# EAGLE board Main (EAGLE 7.4.0)
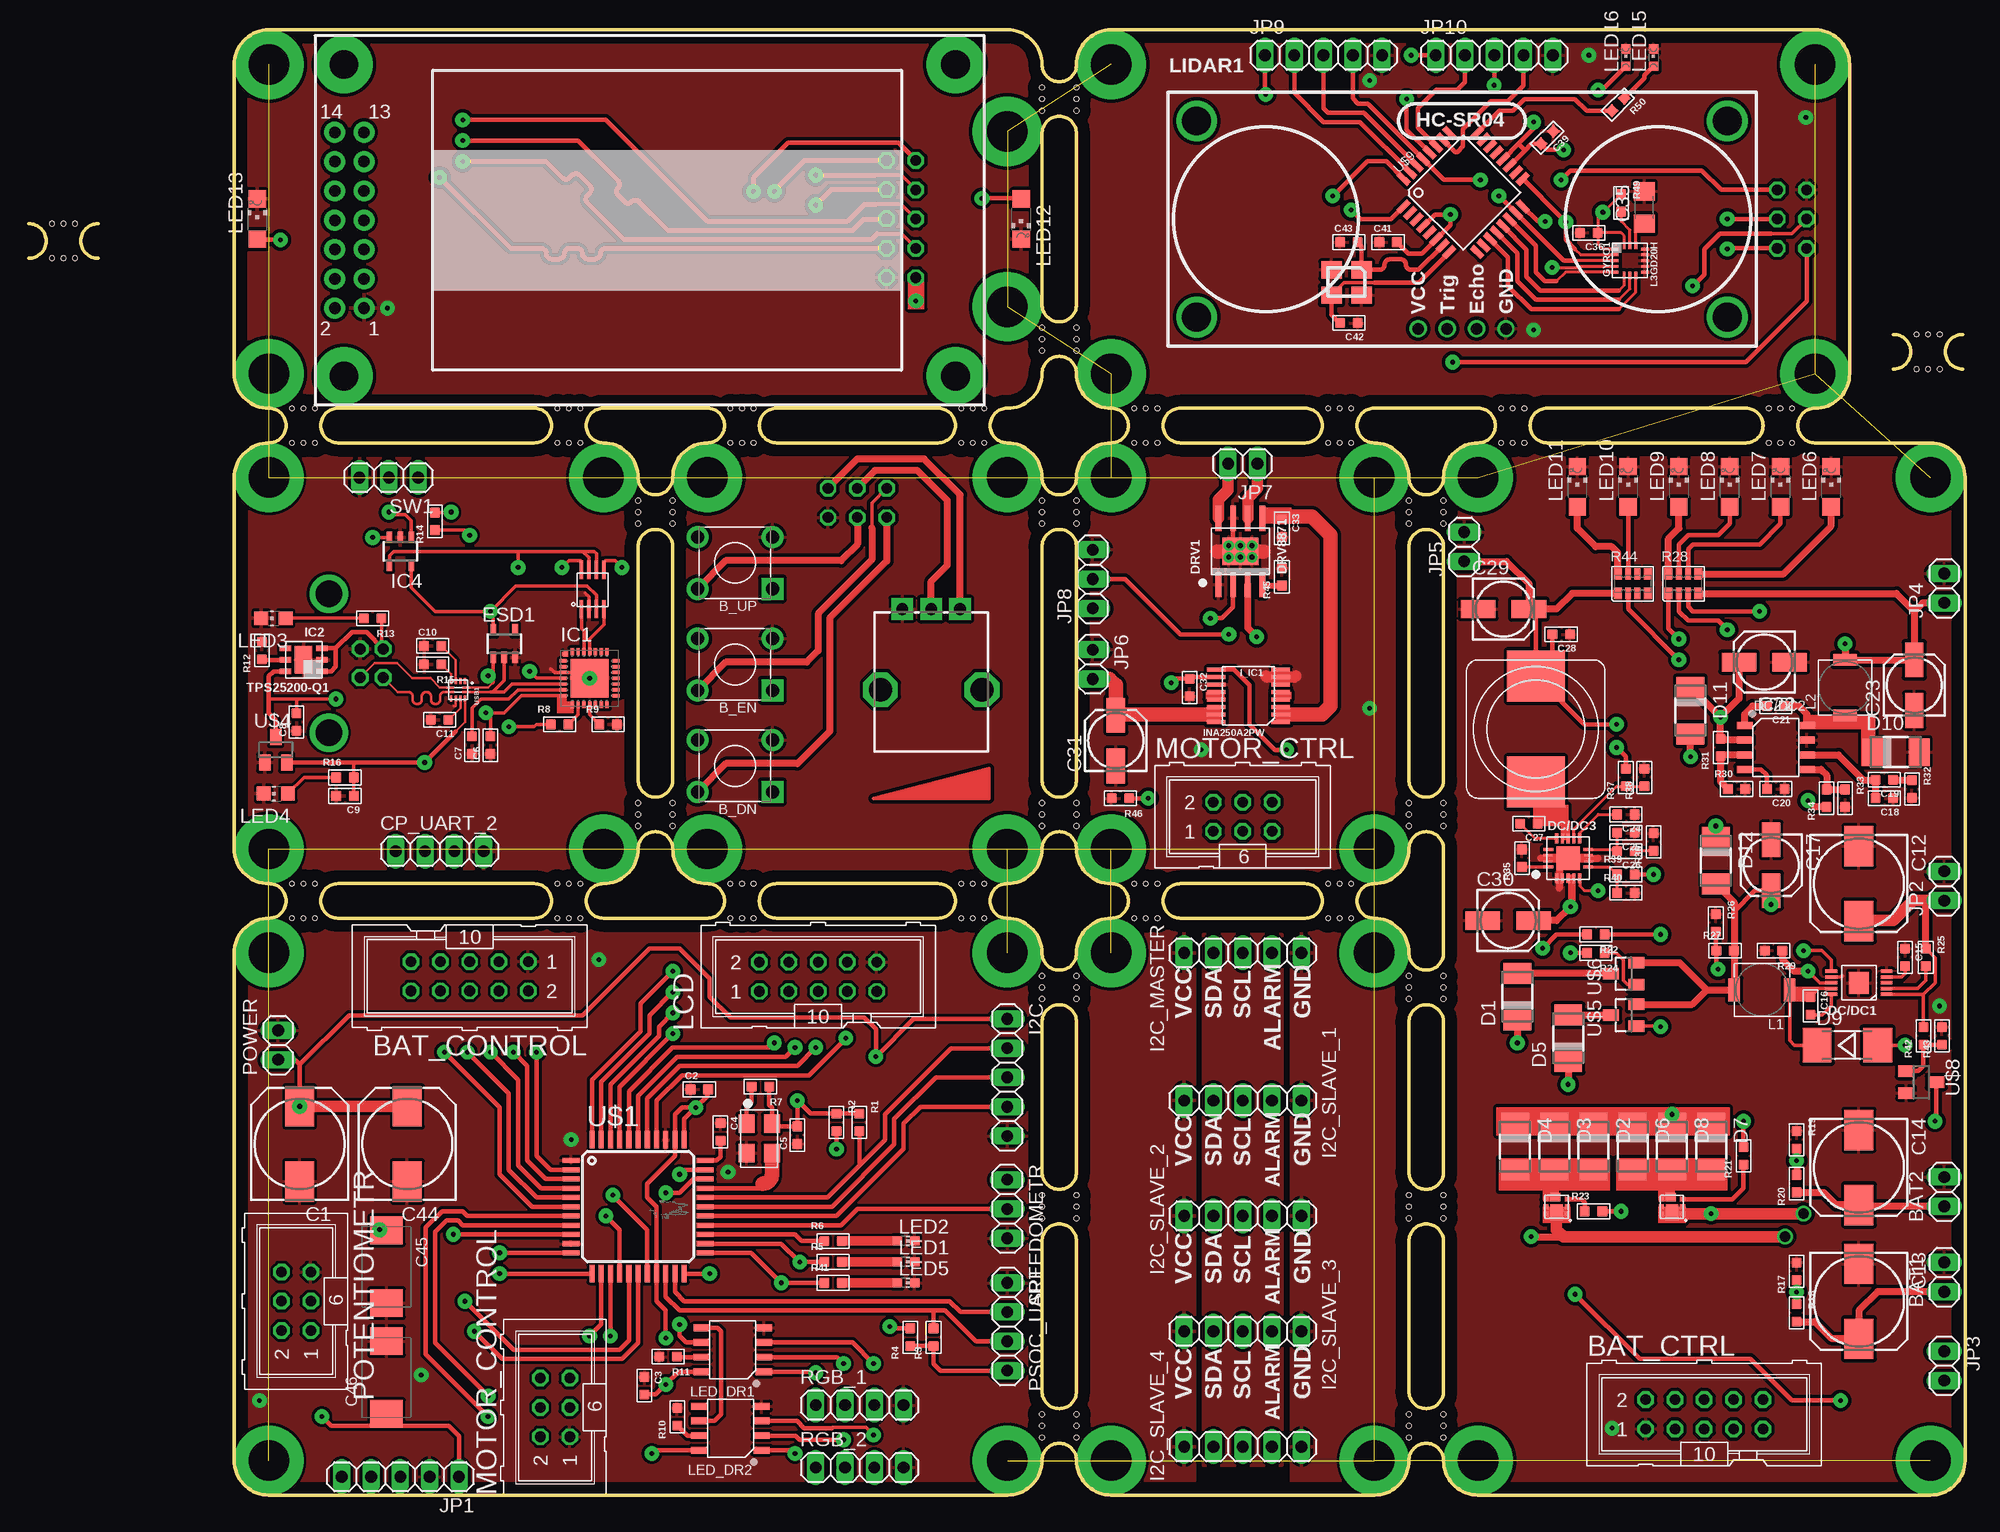
[diagram p5: board, top side]
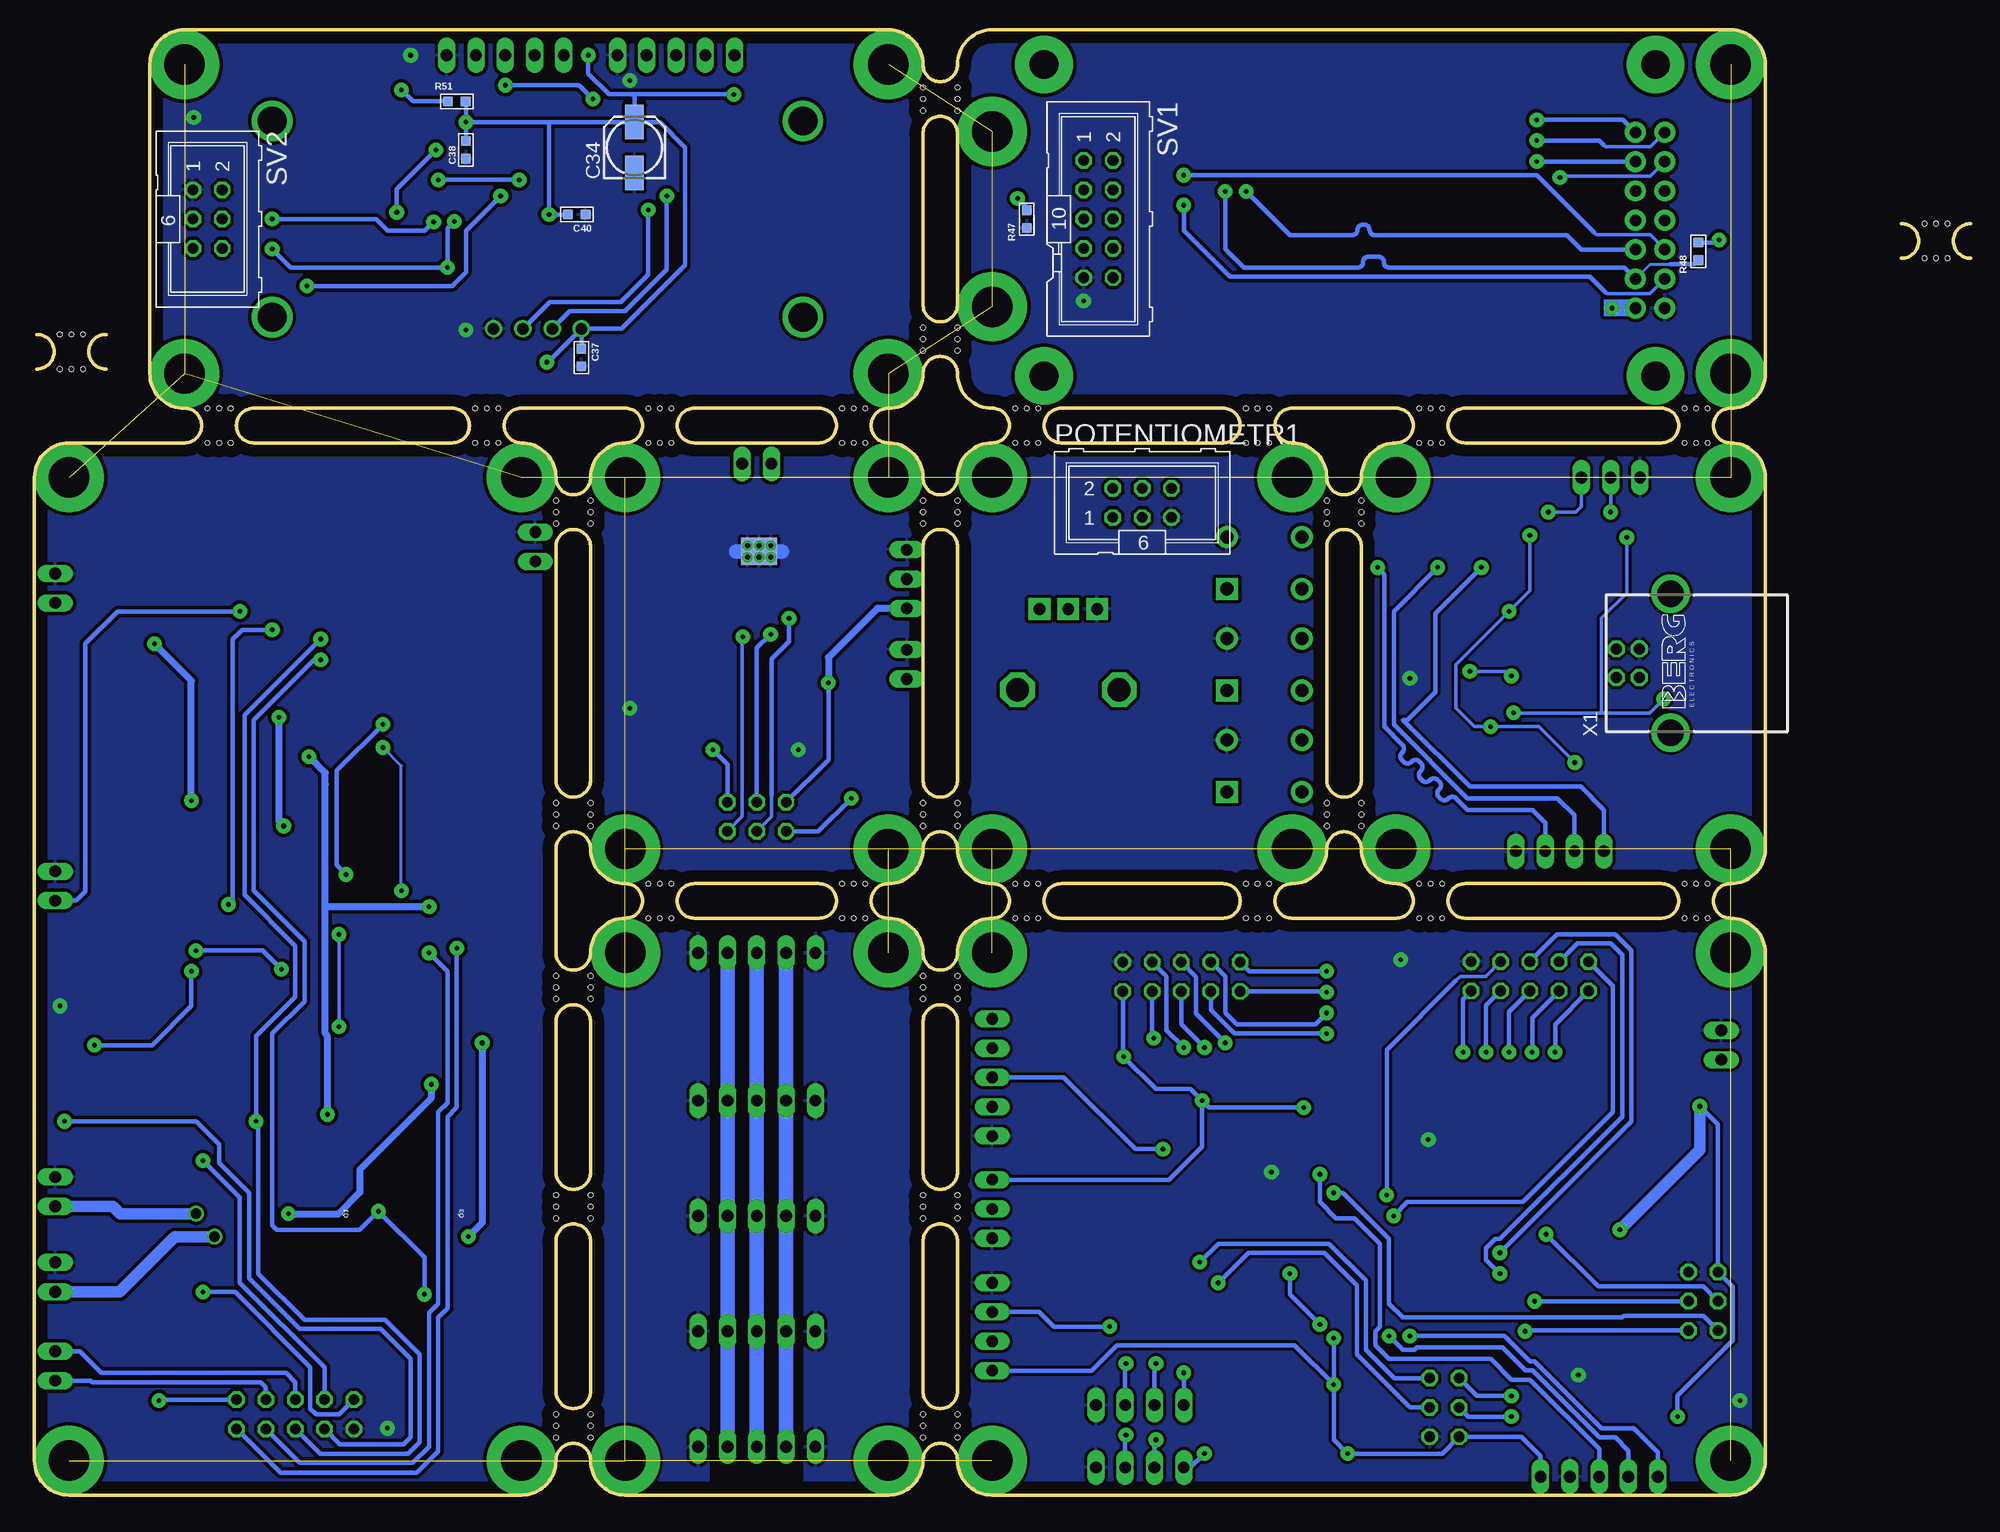
[diagram p6: board, bottom side, seen from below]

Size 167.8 x 127 mm. Coordinates in mm from the lower left corner, seen from the top.
Outline: 6,107.2 arc-180 6,110.2
Outline: 0,110.2 arc-180 0,107.2
Outline: 167.6,97.6 arc-180 167.6,100.6
Outline: 161.6,100.6 arc-180 161.6,97.6
Outline: 20.8,0 84.8,0 arc90 87.8,3 arc-180 90.8,3 arc90 93.8,0 116.6,0 arc90 119.6,3 arc-180 122.6,3 arc90 125.6,0 164.8,0 arc90 167.8,3 167.8,88.2 arc90 164.8,91.2 154.8,91.2 arc-180 154.8,94.2 arc90 157.8,97.2 157.8,124 arc90 154.8,127 93.8,127 arc90 90.8,124 arc-180 87.8,124 arc90 84.8,127 20.8,127 arc90 17.8,124 17.8,97.2 arc90 20.8,94.2 arc-180 20.8,91.2 arc90 17.8,88.2 17.8,56 arc90 20.8,53 arc-180 20.8,50 arc90 17.8,47 17.8,3 arc90 20.8,0
Outline: 87.8,47 arc90 84.8,50 arc-180 84.8,53 arc90 87.8,56 arc-180 90.8,56 arc90 93.8,53 arc-180 93.8,50 arc90 90.8,47 arc-180 87.8,47
Outline: 87.8,22 arc-180 90.8,22 90.8,9 arc-180 87.8,9 87.8,22
Outline: 90.8,28 arc-180 87.8,28 87.8,41 arc-180 90.8,41 90.8,28
Outline: 119.6,47 arc90 116.6,50 arc-180 116.6,53 arc90 119.6,56 arc-180 122.6,56 122.6,47 arc-180 119.6,47
Outline: 84.8,91.2 arc-180 84.8,94.2 arc90 87.8,97.2 arc-180 90.8,97.2 arc90 93.8,94.2 arc-180 93.8,91.2 arc90 90.8,88.2 arc-180 87.8,88.2 arc90 84.8,91.2
Outline: 78.8,94.2 arc-180 78.8,91.2 64.8,91.2 arc-180 64.8,94.2 78.8,94.2
Outline: 26.8,50 arc-180 26.8,53 43.8,53 arc-180 43.8,50 26.8,50
Outline: 78.8,53 arc-180 78.8,50 64.8,50 arc-180 64.8,53 78.8,53
Outline: 49.8,53 arc90 52.8,56 arc-180 55.8,56 arc90 58.8,53 arc-180 58.8,50 49.8,50 arc-180 49.8,53
Outline: 52.8,88.2 arc90 49.8,91.2 arc-180 49.8,94.2 58.8,94.2 arc-180 58.8,91.2 arc90 55.8,88.2 arc-180 52.8,88.2
Outline: 52.8,82.2 arc-180 55.8,82.2 55.8,62 arc-180 52.8,62 52.8,82.2
Outline: 122.6,9 arc-180 119.6,9 119.6,22 arc-180 122.6,22 122.6,9
Outline: 119.6,41 arc-180 122.6,41 122.6,28 arc-180 119.6,28 119.6,41
Outline: 99.8,50 arc-180 99.8,53 110.6,53 arc-180 110.6,50 99.8,50
Outline: 90.8,62 arc-180 87.8,62 87.8,82.2 arc-180 90.8,82.2 90.8,62
Outline: 119.6,88.2 arc90 116.6,91.2 arc-180 116.6,94.2 125.6,94.2 arc-180 125.6,91.2 arc90 122.6,88.2 arc-180 119.6,88.2
Outline: 122.6,62 arc-180 119.6,62 119.6,82.2 arc-180 122.6,82.2 122.6,62
Outline: 26.8,91.2 arc-180 26.8,94.2 43.8,94.2 arc-180 43.8,91.2 26.8,91.2
Outline: 90.8,103.2 arc-180 87.8,103.2 87.8,118 arc-180 90.8,118 90.8,103.2
Outline: 99.8,91.2 arc-180 99.8,94.2 110.6,94.2 arc-180 110.6,91.2 99.8,91.2
Outline: 131.6,91.2 arc-180 131.6,94.2 148.8,94.2 arc-180 148.8,91.2 131.6,91.2
Copper layers (1*16): Top 0.035mm / dielectric 1.5mm / Bottom 0.035mm
Design rules "default": minimum track width 10mil, minimum drill 24mil, track to track 8mil, track to pad 8mil, pad to pad 8mil, via to via 8mil, smd to smd 8mil, copper to edge 40mil, drill to drill 8mil, minimum pad ring 10mil, minimum via ring 8mil, stop-mask expansion 4mil, vias tented up to drill 0mil, thermal gap 10mil
Holes 0.4 mm at 90.8,26 90.8,25 90.8,24 87.8,24 87.8,25 87.8,26 90.8,45 90.8,44 90.8,43 87.8,43 87.8,44 87.8,45 90.8,7 90.8,6 90.8,5 87.8,5 87.8,6 87.8,7 80.8,94.2 81.8,94.2 82.8,94.2 82.8,91.2 81.8,91.2 80.8,91.2 22.8,53 23.8,53 24.8,53 24.8,50 23.8,50 22.8,50 80.8,53 81.8,53 82.8,53 82.8,50 81.8,50 80.8,50 55.8,86.2 55.8,85.2 55.8,84.2 52.8,84.2 52.8,85.2 52.8,86.2 55.8,60 55.8,59 55.8,58 52.8,58 52.8,59 52.8,60 60.8,53 61.8,53 62.8,53 62.8,50 61.8,50 60.8,50 45.8,53 46.8,53 47.8,53 47.8,50 46.8,50 45.8,50 122.6,7 122.6,6 122.6,5 119.6,5 119.6,6 119.6,7 122.6,45 122.6,44 122.6,43 119.6,43 119.6,44 119.6,45 95.8,53 96.8,53 97.8,53 97.8,50 96.8,50 95.8,50 112.6,53 113.6,53 114.6,53 114.6,50 113.6,50 112.6,50 90.8,60 90.8,59 90.8,58 87.8,58 87.8,59 87.8,60 90.8,86.2 90.8,85.2 90.8,84.2 87.8,84.2 87.8,85.2 87.8,86.2 122.6,60 122.6,59 122.6,58 119.6,58 119.6,59 119.6,60 122.6,86.2 122.6,85.2 122.6,84.2 119.6,84.2 119.6,85.2 119.6,86.2 122.6,26 122.6,25 122.6,24 119.6,24 119.6,25 119.6,26 22.8,94.2 23.8,94.2 24.8,94.2 24.8,91.2 23.8,91.2 22.8,91.2 2,110.2 3,110.2 4,110.2 4,107.2 3,107.2 2,107.2 45.8,94.2 46.8,94.2 47.8,94.2 47.8,91.2 46.8,91.2 45.8,91.2 60.8,94.2 61.8,94.2 62.8,94.2 62.8,91.2 61.8,91.2 60.8,91.2 87.8,99.2 87.8,100.2 87.8,101.2 90.8,101.2 90.8,100.2 90.8,99.2 87.8,120 87.8,121 87.8,122 90.8,122 90.8,121 90.8,120 95.8,94.2 96.8,94.2 97.8,94.2 97.8,91.2 96.8,91.2 95.8,91.2 112.6,94.2 113.6,94.2 114.6,94.2 114.6,91.2 113.6,91.2 112.6,91.2 127.6,94.2 128.6,94.2 129.6,94.2 129.6,91.2 128.6,91.2 127.6,91.2 163.6,100.6 164.6,100.6 165.6,100.6 165.6,97.6 164.6,97.6 163.6,97.6 150.8,94.2 151.8,94.2 152.8,94.2 152.8,91.2 151.8,91.2 150.8,91.2

## Footprints (pad centres in the part's own frame; a part is rotated, then mirrored left to right if it is on the bottom)
SW4-6.2X6.2X5.0MM = drill 1.143 pad 1.905 square: 1 -3.25,2.25 | drill 1.143 pad 1.905: 2 -3.25,-2.25; 3 3.25,-2.25; 4 3.25,2.25
1X02 = drill 1.016 long: 1 -1.27,0; 2 1.27,0
ML10 = drill 0.914 octagon: 1 -5.08,-1.27; 2 -5.08,1.27; 3 -2.54,-1.27; 4 -2.54,1.27; 5 0,-1.27; 6 0,1.27; 7 2.54,-1.27; 8 2.54,1.27; 9 5.08,-1.27; 10 5.08,1.27
150CLZ-0810 = smd 3.5 x 2.5: + 3.25,0; - -3.25,0
C0603 = smd 0.889 x 0.889: 1 0,0.762; 2 0,-0.762
153CLV-0810 = smd 3.5 x 2.5: + 3.25,0; - -3.25,0
153CLV-0505 = smd 3 x 1.6: + 2.2,0; - -2.2,0
C1206 = smd 1.6 x 1.8: 1 -1.4,0; 2 1.4,0
SMC_D = smd 2.4 x 2.8: + -3.15,0; - 3.15,0
1X04 = drill 1.016 long: 1 -3.81,0; 2 -1.27,0; 3 1.27,0; 4 3.81,0
DO-214AC = smd 1.8 x 2.4: A 2.025,0; C -2.025,0
MELF-MLL41 = smd 2.5 x 3: A 2.625,0; C -2.625,0
HVSSOP-10 = smd 0.3 x 1.02: 1 -1,-2.4; 2 -0.5,-2.4; 3 0,-2.4; 4 0.5,-2.4; 5 1,-2.4; 6 1,2.4; 7 0.5,2.4; 8 0,2.4; 9 -0.5,2.4; 10 -1,2.4 | smd 1.9 x 1.73: EPAD 0,0
SOIC8-1.27-5X4MM = smd 0.6 x 1.4: 1 -1.905,-2.7; 2 -0.635,-2.7; 3 0.635,-2.7; 4 1.905,-2.7; 5 1.905,2.7; 6 0.635,2.7; 7 -0.635,2.7; 8 -1.905,2.7
VQFN-14_PWR = smd 0.85 x 0.28: 1 -1.725,-0.75; 7 1.725,-0.75; 8 1.725,0.75; 14 -1.725,0.75 | smd 0.28 x 0.85: 2 -1,-1.725; 3 -0.5,-1.725; 4 0,-1.725; 5 0.5,-1.725; 6 1,-1.725; 9 1,1.725; 10 0.5,1.725; 11 0,1.725; 12 -0.5,1.725; 13 -1,1.725 | smd 2.05 x 2.05: EPAD_BIG 0,0 | smd 0.725 x 0.2: EPAD_M1 -1.788,0.275; EPAD_M2 -1.788,-0.275; EPAD_M3 1.788,-0.275; EPAD_M4 1.788,0.275
HTSOP8 = smd 0.5 x 2.2: 1 -1.905,-2.875; 2 -0.635,-2.875; 3 0.635,-2.875; 4 1.905,-2.875; 5 1.905,2.875; 6 0.635,2.875; 7 -0.635,2.875; 8 -1.905,2.875 | smd 3.1 x 2.4 bottom: EPAD_B 0,0 | smd 3.1 x 2.4: EPAD_T 0,0 | drill 0.4: EPAD_VIA1 -1,0.5; EPAD_VIA2 0,0.5; EPAD_VIA3 1,0.5; EPAD_VIA4 1,-0.5; EPAD_VIA5 0,-0.5; EPAD_VIA6 -1,-0.5
SOT23-5 = smd 0.5 x 1: 1 -0.95,-1.2; 2 0,-1.2; 3 0.95,-1.2; 4 0.95,1.2; 5 -0.95,1.2
LGA_3X3_16 = smd 0.25 x 0.65: 1 -1,-1.35; 2 -0.5,-1.35; 3 0,-1.35; 4 0.5,-1.35; 5 1,-1.35; 9 1,1.25; 10 0.5,1.25; 11 0,1.25; 12 -0.5,1.25; 13 -1,1.25 | smd 0.65 x 0.25: 6 1.3,-0.545; 7 1.3,-0.045; 8 1.3,0.455; 14 -1.3,0.455; 15 -1.3,-0.045; 16 -1.3,-0.545
1X05 = drill 1.016 long: 1 -5.08,0; 2 -2.54,0; 3 0,0; 4 2.54,0; 5 5.08,0
SSOP16 = smd 0.35 x 1.6: P$1 -2.3,-2.9; P$2 -1.65,-2.9; P$3 -1,-2.9; P$4 -0.35,-2.9; P$5 0.3,-2.9; P$6 0.95,-2.9; P$7 1.6,-2.9; P$8 2.25,-2.9; P$9 2.25,2.7; P$10 1.6,2.7; P$11 0.95,2.7; P$12 0.3,2.7; P$13 -0.35,2.7; P$14 -1,2.7; P$15 -1.65,2.7; P$16 -2.3,2.7
MLP28 = smd 0.6 x 0.3: 1 -2.3,1.5; 2 -2.3,1; 3 -2.3,0.5; 4 -2.3,0; 5 -2.3,-0.5; 6 -2.3,-1; 7 -2.3,-1.5; 15 2.3,-1.5; 16 2.3,-1; 17 2.3,-0.5; 18 2.3,0; 19 2.3,0.5; 20 2.3,1; 21 2.3,1.5 | smd 0.3 x 0.6: 8 -1.5,-2.3; 9 -1,-2.3; 10 -0.5,-2.3; 11 0,-2.3; 12 0.5,-2.3; 13 1,-2.3; 14 1.5,-2.3; 22 1.5,2.3; 23 1,2.3; 24 0.5,2.3; 25 0,2.3; 26 -0.5,2.3; 27 -1,2.3; 28 -1.5,2.3 | smd 3.3 x 3.3: EXP 0,0 | smd 0.435 x 0.435: M -2.103,2.103
PWSON6 = smd 1.5 x 2.4: EPAD 0,0 | smd 1 x 0.45: P$1 -1.6,1; P$2 -1.6,0; P$3 -1.6,-1; P$4 1.55,-1; P$5 1.55,0; P$6 1.55,1
1X03 = drill 1.016 long: 1 -2.54,0; 2 0,0; 3 2.54,0
INT2-SMD-4.8X4.6X1.0MM = smd 1 x 2: 1 -2.4,0; 2 2.4,0
LDCP = smd 5 x 4.4: P$1 0,4.6; P$2 0,-4.6
CHIP-LED0603 = smd 0.8 x 0.8: A 0,-0.75; C 0,0.75
CHIP-LED0805 = smd 1.2 x 1.2: A 0,-1.05; C 0,1.05
CHIPLED_1206 = smd 1.5 x 1.5: A 0,-1.75; C 0,1.75
CHIPLED_0603 = smd 0.8 x 0.8: A 0,-0.75; C 0,0.75
HC-SR04 = drill 1: 1 -3.81,-9.5; 2 -1.27,-9.5; 3 1.27,-9.5; 4 3.81,-9.5 | drill 2.5: DRIL1 -23,-8.5; DRIL2 -23,8.5; DRIL3 23,8.5; DRIL4 23,-8.5
ML6 = drill 0.914 octagon: 1 -2.54,-1.27; 2 -2.54,1.27; 3 0,-1.27; 4 0,1.27; 5 2.54,-1.27; 6 2.54,1.27
SON_Q2 = smd 0.4 x 0.45: 1 -0.65,-0.922; 2 0,-0.922; 3 0.65,-0.922; 4 0.65,0.922; 5 0,0.922; 6 -0.65,0.922 | smd 0.75 x 0.85: D 0.825,0.096 | smd 1.4 x 1.1: S -0.505,0
R0603 = smd 0.889 x 0.889: 1 0,0.762; 2 0,-0.762
RA1206-8 = smd 0.7 x 1: 1 -1.3,-0.85; 4 1.3,-0.85; 5 1.3,0.85; 8 -1.3,0.85 | smd 0.5 x 1: 2 -0.4,-0.85; 3 0.4,-0.85; 6 0.4,0.85; 7 -0.4,0.85
ALPS_POT = drill 1 pad 1.88 square: P$1 7,-2.5; P$2 7,0; P$3 7,2.5 | drill 2 octagon: P$4 0,-4.4; P$5 0,4.4
TQFP44_CY_LOGO = smd 1.5 x 0.44: 1 -5.8,4; 2 -5.8,3.2; 3 -5.8,2.4; 4 -5.8,1.6; 5 -5.8,0.8; 6 -5.8,0; 7 -5.8,-0.8; 8 -5.8,-1.6; 9 -5.8,-2.4; 10 -5.8,-3.2; 11 -5.8,-4; 23 5.8,-4; 24 5.8,-3.2; 25 5.8,-2.4; 26 5.8,-1.6; 27 5.8,-0.8; 28 5.8,0; 29 5.8,0.8; 30 5.8,1.6; 31 5.8,2.4; 32 5.8,3.2; 33 5.8,4 | smd 0.44 x 1.5: 12 -4,-5.8; 13 -3.2,-5.8; 14 -2.4,-5.8; 15 -1.6,-5.8; 16 -0.8,-5.8; 17 0,-5.8; 18 0.8,-5.8; 19 1.6,-5.8; 20 2.4,-5.8; 21 3.2,-5.8; 22 4,-5.8; 34 4,5.8; 35 3.2,5.8; 36 2.4,5.8; 37 1.6,5.8; 38 0.8,5.8; 39 0,5.8; 40 -0.8,5.8; 41 -1.6,5.8; 42 -2.4,5.8; 43 -3.2,5.8; 44 -4,5.8
5030A = smd 1.6 x 1.4: 1 0,-2.2; 2 2.54,-2.2; 3 2.54,0; 4 0,0
SM8 = smd 0.3 x 1.6: A1 1.05,1.6; A2 1.05,-1.8; B1 -0.9,1.6; B2 -0.9,-1.8; GND -0.25,-1.8; OE 0.4,1.6; VCCA 0.4,-1.8; VCCB -0.25,1.6
SOT23 = smd 1 x 1.4: 1 -0.95,-1.1; 2 0.95,-1.1; 3 0,1.1
SOT23' = smd 1 x 1.4: D 0,1.1; G -0.95,-1.1; S 0.95,-1.1
7X2 = drill 1 pad 1.8: 1 4.24,8.38; 2 1.7,8.38; 3 4.24,10.92; 4 1.7,10.92; 5 4.24,13.46; 6 1.7,13.46; 7 4.24,16; 8 1.7,16; 9 4.24,18.54; 10 1.7,18.54; 11 4.24,21.08; 12 1.7,21.08; 13 4.24,23.62; 14 1.7,23.62 | drill 2.5 pad 5: P$1 2.5,2.5; P$2 2.5,29.5; P$3 55.5,2.5; P$4 55.5,29.5
SOT23W = smd 1 x 1.4: D 0,1.303; G -0.95,-1.303; S 0.95,-1.303
TQFP32-08 = smd 1.27 x 0.508: ADC6 4.5,-1.2; ADC7 4.5,1.2; AREF 4.5,-0.4; AVCC 4.5,-2; B5 4.5,-2.8; B6 -4.5,-2; B7 -4.5,-2.8; C0 4.5,2; C1 4.5,2.8; D3 -4.5,2.8; D4 -4.5,2; GND 4.5,0.4; GND1 -4.5,-0.4; GND2 -4.5,1.2; VCC -4.5,-1.2; VCC1 -4.5,0.4 | smd 0.508 x 1.27: B0 -0.4,-4.5; B1 0.4,-4.5; B2 1.2,-4.5; B3 2,-4.5; B4 2.8,-4.5; C2 2.8,4.5; C3 2,4.5; C4 1.2,4.5; C5 0.4,4.5; C6 -0.4,4.5; D0 -1.2,4.5; D1 -2,4.5; D2 -2.8,4.5; D5 -2.8,-4.5; D6 -2,-4.5; D7 -1.2,-4.5
3225 = smd 1.778 x 1.5: 1 0.3,0.2; 2 2.9,0.2; 3 2.9,2.4; 4 0.3,2.4
X2QFN = smd 0.7 x 0.2: 1 -0.7,0.2; 2 -0.7,-0.2; 7 0.7,-0.2; 8 0.7,0.2 | smd 0.2 x 0.5: 3 -0.6,-0.75; 4 -0.2,-0.75; 5 0.2,-0.75; 6 0.6,-0.75; 9 0.6,0.75; 10 0.2,0.75; 11 -0.2,0.75; 12 -0.6,0.75
PN61729-S = drill 0.95 octagon: 1 1.25,4.71; 2 -1.25,4.71; 3 -1.25,2.71; 4 1.25,2.71 | drill 2.3 pad 2.9: S1 -6.02,0; S2 6.02,0

## Placement (x,y rotation side)
B_DN  TS-1109-7  [SW4-6.2X6.2X5.0MM]  61.2,63.2 180 top
B_EN  TS-1109-7  [SW4-6.2X6.2X5.0MM]  61.2,72 180 top
B_UP  TS-1109-7  [SW4-6.2X6.2X5.0MM]  61.2,80.8 180 top
BAT1  [1X02]  166,18.9 90 top
BAT2  [1X02]  166,26.3 90 top
BAT_CONTROL  [ML10]  38.2,44.97 180 top
BAT_CTRL  [ML10]  145.2,7 0 top
C1  [150CLZ-0810]  23.47,30.44 90 top
C2  [C0603]  58.11,35.16 90 top
C3  [C0603]  53.35,9.49 0 top
C4  [C0603]  59.94,31.49 0 top
C5  [C0603]  66.6,31.2 180 top
C6  [C0603]  40,65 180 top
C7  [C0603]  38.4,65 180 top
C8  [C0603]  23.2,67 180 top
C9  [C0603]  27.4,60.6 270 top
C10  [C0603]  35,73.6 90 top
C11  [C0603]  35.6,67.2 270 top
C12  [153CLV-0810]  158.6,53 270 top
C13  [153CLV-0810]  158.6,16.8 270 top
C14  [153CLV-0810]  158.6,28.4 270 top
C15  [C0603]  162.6,46.6 0 top
C16  [C0603]  154.4,42.4 0 top
C17  [153CLV-0505]  151,54.6 270 top
C18  [C0603]  160.8,60.4 270 top
C19  [C0603]  160.8,62 270 top
C20  [C0603]  151.4,61.2 270 top
C21  [C0603]  151.4,68.4 270 top
C22  [153CLV-0505]  150.4,72.2 180 top
C23  [153CLV-0505]  163.4,70.2 90 top
C24  [C0603]  138.4,59 270 top
C25  [C0603]  138.4,57.4 270 top
C26  [C0603]  138.4,55.8 270 top
C27  [C0603]  130,58.2 270 top
C28  [C0603]  132.8,74.6 270 top
C29  [153CLV-0505]  127.8,76.8 0 top
C30  [153CLV-0505]  128.2,49.8 0 top
C31  [153CLV-0505]  94.2,65.4 90 top
C32  [C0603]  100.6,70 0 top
C33  [C0603]  108.6,83.8 0 top
C34  [153CLV-0505]  115.8,116.8 90 bottom
C35  [C1206]  140,111.6 90 top
C36  [C0603]  135.2,109.4 270 top
C37  [C0603]  120.4,98.6 0 bottom
C38  [C0603]  130.4,116.6 180 bottom
C39  [C0603]  131.58,117.66 315 top
C40  [C0603]  120.8,111 270 bottom
C41  [C0603]  117.8,108.6 90 top
C42  [C0603]  114.4,101.6 270 top
C43  [C0603]  114.4,108.6 90 top
C44  [150CLZ-0810]  32.8,30.44 90 top
C45  [SMC_D]  31,19.8 270 top
C46  [SMC_D]  31,10.2 90 top
CP_UART_2  [1X04]  35.6,55.8 0 top
D1  [DO-214AC]  129,43.2 90 top
D2  [DO-214AC]  135.6,30.2 270 top
D3  [DO-214AC]  132.2,30.2 270 top
D4  [DO-214AC]  128.8,30.2 270 top
D5  [DO-214AC]  133.4,39.6 90 top
D6  [DO-214AC]  139,30.2 270 top
D7  [DO-214AC]  145.8,30.2 270 top
D8  [DO-214AC]  142.4,30.2 270 top
D9  [MELF-MLL41]  157.6,39 0 top
D10  [DO-214AC]  161.8,64.4 0 top
D11  [DO-214AC]  144,68 270 top
D12  [DO-214AC]  146.2,55 270 top
DC/DC1  [HVSSOP-10]  158.6,44.4 90 top
DC/DC2  [SOIC8-1.27-5X4MM]  151.4,64.8 270 top
DC/DC3  [VQFN-14_PWR]  133.4,55.2 0 top
DRV1  DRV8871  [HTSOP8]  105,81.8 0 top
ESD1  TPD3E001  [SOT23-5]  41.2,73.8 0 top
GYRO1  L3GD20H  [LGA_3X3_16]  138.8,107 270 top
I2C  [1X05]  84.8,36.2 270 top
I2C_MASTER  [1X05]  105.2,47 0 top
I2C_SLAVE_1  [1X05]  105.2,34.2 0 top
I2C_SLAVE_2  [1X05]  105.2,24.2 0 top
I2C_SLAVE_3  [1X05]  105.2,14.2 0 top
I2C_SLAVE_4  [1X05]  105.2,4.2 0 top
I_IC1  INA250A2PW  [SSOP16]  105.6,69.3 90 top
IC1  CP2102  [MLP28]  48.6,70.8 0 top
IC2  TPS25200-Q1  [PWSON6]  23.8,72.4 180 top
IC4  TPS2105-EP  [SOT23-5]  32.2,81.8 180 top
JP1  [1X05]  32.2,1.6 180 top
JP2  [1X02]  166,52.8 90 top
JP3  [1X02]  166,11.2 270 top
JP4  [1X02]  166,78.6 90 top
JP5  [1X02]  124.4,82.2 90 top
JP6  [1X02]  92.2,72 270 top
JP7  [1X02]  105.2,89.4 180 top
JP8  [1X03]  92.2,79.4 90 top
JP9  [1X05]  112.2,124.8 0 top
JP10  [1X05]  127,124.8 0 top
L1  2.2UH-2A  [INT2-SMD-4.8X4.6X1.0MM]  150.2,43.8 180 top
L2  2.2UH-2A  [INT2-SMD-4.8X4.6X1.0MM]  157.4,70 90 top
L$1  [LDCP]  130.6,66.4 180 top
LCD  [ML10]  68.4,44.93 0 top
LED1  [CHIP-LED0603]  76.02,20.22 270 top
LED2  [CHIP-LED0603]  76.02,22.03 270 top
LED3  [CHIP-LED0805]  21.2,76 90 top
LED4  [CHIP-LED0805]  21.4,60.8 90 top
LED5  [CHIP-LED0603]  76.02,18.4 270 top
LED6  [CHIPLED_1206]  156.2,87.4 0 top
LED7  [CHIPLED_1206]  151.8,87.4 0 top
LED8  [CHIPLED_1206]  147.4,87.4 0 top
LED9  [CHIPLED_1206]  143,87.4 0 top
LED10  [CHIPLED_1206]  138.6,87.4 0 top
LED11  [CHIPLED_1206]  134.2,87.4 0 top
LED12  [CHIPLED_1206]  86,110.6 180 top
LED13  [CHIPLED_1206]  19.8,110.6 0 top
LED15  [CHIPLED_0603]  140.8,124.6 0 top
LED16  [CHIPLED_0603]  138.4,124.6 0 top
LED_DR1  TLC5973  [SOIC8-1.27-5X4MM]  61,12.6 90 top
LED_DR2  TLC5973  [SOIC8-1.27-5X4MM]  60.8,5.8 90 top
LIDAR1  HC-SR04  [HC-SR04]  124.2,110.6 0 top
MOTOR_CONTROL  [ML6]  45.6,7.6 90 top
MOTOR_CTRL  [ML6]  105.2,58.8 0 top
POTENTIOMETR  [ML6]  23.17,16.81 90 top
POTENTIOMETR1  [ML6]  71.8,86 0 bottom
POWER  [1X02]  21.61,39.01 90 top
PSOC_UART  [1X04]  84.8,14.6 270 top
Q1  CSD25310Q2  [SON_Q2]  142.4,25 90 top
Q3  CSD25310Q2  [SON_Q2]  132.4,25 90 top
R1  [R0603]  71.98,32.31 180 top
R2  [R0603]  69.99,32.31 180 top
R3  [R0603]  78.4,13.69 0 top
R4  [R0603]  76.39,13.69 0 top
R5  [R0603]  69.69,20.22 270 top
R6  [R0603]  69.69,22.03 270 top
R7  [R0603]  63.4,35.4 90 top
R8  [R0603]  46,66.8 270 top
R9  [R0603]  50.2,66.8 270 top
R10  [R0603]  56.2,6.8 0 top
R11  [R0603]  55.4,12 90 top
R12  [R0603]  20.2,73.2 0 top
R13  [R0603]  29.8,76 90 top
R14  [R0603]  35.2,84.4 0 top
R15  [R0603]  35,72 90 top
R16  [R0603]  27.4,62.2 270 top
R17  [R0603]  153.2,19.4 0 top
R18  [R0603]  153.2,15.8 180 top
R19  [R0603]  153.2,30.8 180 top
R20  [R0603]  153.2,27 0 top
R21  [R0603]  148.6,29.4 0 top
R22  [R0603]  135.8,48.6 90 top
R23  [R0603]  135.6,24.6 270 top
R24  [R0603]  135.8,47 90 top
R25  [R0603]  164.4,46.6 180 top
R26  [R0603]  146.2,49.6 180 top
R27  [R0603]  147,47.2 270 top
R28  [RA1206-8]  143.4,79 0 top
R29  [R0603]  151.2,47.2 90 top
R30  [R0603]  148,61.2 270 top
R31  [R0603]  146.6,64.8 0 top
R32  [R0603]  163.2,61.2 180 top
R33  [R0603]  157.4,60.4 180 top
R34  [R0603]  155.8,60.4 0 top
R35  [R0603]  129.4,55.2 0 top
R36  [R0603]  140.8,56.6 0 top
R37  [R0603]  138.4,62.2 0 top
R38  [R0603]  140,62.2 0 top
R39  [R0603]  138.4,53.8 270 top
R40  [R0603]  138.4,52.2 270 top
R41  [R0603]  69.69,18.4 270 top
R42  [R0603]  164.2,39.8 0 top
R43  [R0603]  165.8,39.8 0 top
R44  [RA1206-8]  139,79 0 top
R45  [R0603]  108.6,79.6 0 top
R46  [R0603]  94.6,60.4 90 top
R47  [R0603]  81.8,110.6 0 bottom
R48  [R0603]  23.6,107.8 0 bottom
R49  [R0603]  138,112 180 top
R50  [R0603]  137.72,120.52 135 top
R51  [R0603]  131.2,120.8 270 bottom
RGB_1  [1X04]  72,7.8 0 top
RGB_2  [1X04]  72,2.4 0 top
RV1  [ALPS_POT]  78.2,69.8 90 top
SPEEDOMETR  [1X03]  84.8,24.8 270 top
SV1  [ML10]  75.6,110.6 270 bottom
SV2  [ML6]  152.8,110.6 270 bottom
SW1  [1X03]  31.2,88.2 180 top
U$1  CY8C4245  [TQFP44_CY_LOGO]  52.8,25 0 top
U$2  5032ACTIVE  [5030A]  64.4,32.2 270 top
U$3  TXS0102_SM8  [SM8]  48.8,78.6 0 top
U$4  XC6206_3.3  [SOT23]  21.4,64.6 0 top
U$5  PSOT23  [SOT23']  138.2,41.6 90 top
U$6  PSOT23  [SOT23']  138.2,45.2 90 top
U$7  8X2_KS066  [7X2]  24.81,94.5 0 top
U$8  NSOT23  [SOT23W]  164,35.8 270 top
U$9  ATMEGAN8  [TQFP32-08]  124.31,112.89 45 top
U$10  3225PASSIVE  [3225]  115.8,106.4 180 top
USB1  TUSB211QRWBRQ1  [X2QFN]  37.2,69.8 180 top
X1  PN61729-S  [PN61729-S]  26,72.1 90 bottom

## Tracks (layer width: path | path; a pad name or v marks a point on that pad's centre or on a via)
+5V  (via drill 0.4 pad 1.27)
  Top 0.305: C46.+ 31.2,6.85 31.2,6
  Top 0.406: R7.2 64.16,33.84 64.4,33.6 U$2.4 arc90 64.64,31.96 C5.2 v66.6,34.2 67.73,33.07 R2.2 R1.2 | POWER.1 23.06,37.74 23.47,37.33 | 23.47,37.33 C1.+ | LED_DR2.8 54.3,3.9 v54,3.6 | LED_DR1.8 56.3,10.7 v55.2,9.6 54.33,8.73 C3.2 | U$1.34 56.8,32.6 v57.8,33.6 | v57.8,33.6 56.6,33.6 56,33 U$1.35 56,29.4 53.6,27 53.6,25.8 54.4,25 U$1.19 54.4,16.8 55.2,16 v55.2,13.6 | 23.47,37.33 27.74,41.6 48,41.6 53.8,47.4 56.4,47.4 59,44.8 59,43.2 60.8,41.4 72.4,41.4 73.4,40.4 v73.4,38 76.68,41.28 I2C.1 | PSOC_UART.4 79,10.79 78.4,11.39 R3.2 R4.2 | JP1.1 37.28,5.12 36.4,6 31.2,6 26.2,6 v25.4,6.8 | v57.8,33.6 58.8,34.6 58.8,35.09 C2.2
  Top 1.016: C1.+ C44.+ | C45.+ 30.95,23 v30.4,23
  Bottom 0.406: C1.+ 21.9,32.12 POTENTIOMETR.6 20.6,18.05 20.6,13.4 25.4,8.6 v25.4,6.8 | v54,3.6 53.86,3.46 | v55.2,13.6 v55.2,9.6 | v55.2,9.6 55.2,4.8 v54,3.6 | v66.6,34.2 67.6,35.2 70.6,35.2 v73.4,38 73.48,38.08 LCD.9 | v57.8,33.6 66,33.6 v66.6,34.2 | PSOC_UART.4 76.21,10.79 74,13 58.6,13 v55.2,9.6 | SPEEDOMETR.1 69.46,27.34 66.6,30.2 v66.6,34.2 | JP1.1 37.28,3.4 38.94,5.06 MOTOR_CONTROL.2 45.8,3.6 v54,3.6
  Bottom 1.016: v30.4,23 23.47,29.93 C1.+
  other vias: 23.47,33.69
+15V  (via drill 0.4 pad 1.27)
  Top 0.3: DC/DC1.1 164.2,43.4 | 164.2,43.4 165.2,44.4 165.2,46.56 R25.2 | R42.1 164.2,43.4
  Top 0.4: R28.3 143.8,77 144.2,76.6 v150,76.6
  Top 0.6: R25.2 164.4,51.33 164.2,51.53
  Top 1: JP2.1 164.2,51.53 163.33,51.53 161.6,49.8 159.85,49.8 C12.+
  Bottom 0.4: v150,76.6 160.6,76.6 163.4,73.8 163.4,52.33 164.2,51.53 JP2.1
ALARM
  Bottom 1.27: I2C_SLAVE_4.4 I2C_SLAVE_3.4 I2C_SLAVE_2.4 I2C_SLAVE_1.4 I2C_MASTER.4
ATM_GND  (via drill 0.4 pad 1.27)
  other vias: 116.2,122.6 135.2,124.8 154,119.4 130.4,101
  pour Top (isolate 0.3): 90.8,94.2 90.8,127 157.8,127 157.8,94.2
  pour Bottom (isolate 0.3): 157.8,94.2 157.8,127 90.8,127 90.8,94.2
ATM_RESET  (via drill 0.4 pad 1.27)
  Top 0.4: JP9.4 114.74,121.06 115.2,120.6 116.03,120.6 U$9.C6 122.63,114 v125.8,114 | v132.8,114 133.6,114.8 145,114.8 146.66,113.14 SV2.2
  Bottom 0.4: v125.8,114 v132.8,114
ATM_VCC  (via drill 0.4 pad 1.27)
  Top 0.25: GYRO1.1 136.4,108 136,108.4 136,109.4 | 136,109.4 136,110.76 v136.42,111.18 | 136.62,111.38 R49.2 | 136,109.4 C36.1 138,109.4 138.25,109.14 GYRO1.16
  Top 0.4: JP10.1 v119.8,124.8 | v107.2,121.4 107.12,121.48 JP9.1 | U$9.AREF 129.09,117.11 | 129.09,117.11 130.4,118.42 v130.4,119 | U$9.ADC6 129.6,116.49 | 129.6,116.49 129.6,116.6 129.09,117.11 | U$9.VCC1 121.85,111 v123.2,111 123.2,110.09 U$9.VCC 120.71,107.6 119.56,107.6 C41.2 | 129.6,116.49 130.23,117.12 C39.2 131.56,116.6 v133,116.6 | v136.42,111.18 136.62,111.38 | SV2.5 154.07,103.47 148.8,98.2 v123.4,98.2
  Bottom 0.4: v119.8,124.8 119.8,123.2 118,121.4 115.8,121.4 | 115.8,121.4 v107.2,121.4 | C34.+ 115.8,121.4 | LIDAR1.1 116.9,101.1 111.4,106.6 111.4,116.8 113.6,119 C34.+ | v130.4,119 123.2,119 | 123.2,119 C34.+ | 123.2,119 v123.2,111 C40.2 | C38.2 v130.4,119 | v133,116.6 136.42,113.18 v136.42,111.18 | v123.4,98.2 123.29,98.2 LIDAR1.1 | LIDAR1.1 120.39,99.37 C37.1 | R51.1 130.4,120.76 v130.4,119
B1  (via drill 0.4 pad 1.27)
  Top 0.406: U$1.16 52,13.4 51.2,12.6 42,12.6 v37.8,16.8
  Bottom 0.406: v37.8,16.8 POTENTIOMETR.3
B1_CHARGE_EN  (via drill 0.4 pad 1.27)
  Top 0.4: U$1.12 v40.8,19.2
  Bottom 0.4: v40.8,19.2 42,20.4 42,21.4 41.2,22.2 40.8,22.2 30.2,32.8 30.2,46.8 31.2,47.8 34.1,47.8 BAT_CONTROL.7
B1_PL  (via drill 0.4 pad 1.27)
  Top 0.4: U$1.2 45.2,28.2 44,29.4 v44,38.4
  Bottom 0.4: v44,38.4 44,42.98 BAT_CONTROL.2
B1_TEMP  (via drill 0.4 pad 1.27)
  Top 0.4: U$1.4 44.4,26.6 42.4,28.6 42.4,36 v40,38.4
  Bottom 0.4: v40,38.4 40,41.9 BAT_CONTROL.6
B2  (via drill 0.4 pad 1.27)
  Top 0.406: U$1.17 52.8,13.2 51.4,11.8 41,11.8 v38.6,14.2
  Bottom 0.406: v38.6,14.2 38.53,14.27 POTENTIOMETR.1
B2_CHARGE_EN  (via drill 0.4 pad 1.27)
  Top 0.4: U$1.15 51.2,23 v50,24.2
  Bottom 0.4: v50,24.2 48.8,25.4 38.8,25.4 31,33.2 31,44.12 BAT_CONTROL.9
B2_PL  (via drill 0.4 pad 1.27)
  Top 0.4: U$1.3 44.8,27.4 43.2,29 43.2,37.2 v42,38.4
  Bottom 0.4: v42,38.4 42,42.44 BAT_CONTROL.4
B2_TEMP  (via drill 0.4 pad 1.27)
  Top 0.4: U$1.5 44,25.8 41.6,28.2 41.6,34.8 v38,38.4
  Bottom 0.4: v38,38.4 38,41.36 BAT_CONTROL.8
B3  (via drill 0.4 pad 1.27)
  Top 0.406: U$1.31 57.6,27.4 56.4,26.2 v55.2,26.2
  Bottom 0.406: v55.2,26.2 54.4,26.2 50.4,22.2 50.4,16.6 49.2,15.4 30.2,15.4 30.06,15.54 23.17,15.54 POTENTIOMETR.2
B_DN
  Top 0.6: POTENTIOMETR1.1 74.34,80.94 69.4,76 69.4,66.2 66.6,63.4 60.4,63.4 B_DN.4
B_ENT
  Top 0.3: POTENTIOMETR1.2 73.07,86 73.07,83.82
  Top 0.6: 73.07,83.82 73.07,81.07 68.4,76.4 68.4,73.2 67.4,72.2 60.4,72.2 B_EN.4
B_UP
  Top 0.6: POTENTIOMETR1.3 71.8,82.4 70.4,81 60.4,81 B_UP.4
BAT1_CHARGE_EN  (via drill 0.4 pad 1.27)
  Top 0.4: v133.6,47 R24.1
  Bottom 0.4: BAT_CTRL.7 144.81,2.79 135,2.79 133.6,4.2 133.6,15.8 132.8,16.6 132.8,33.2 132,34 132,45.4 v133.6,47
BAT1_EN  (via drill 0.4 pad 1.27)
  Top 0.4: U$1.6 43.6,25 40.8,27.8 40.8,33.6 v36,38.4
  Bottom 0.4: v36,38.4 36,40.82 BAT_CONTROL.10
BAT1_OUT_EN  (via drill 0.4 pad 1.27)
  Top 0.4: v157,8.2 152.8,8.2 149.2,11.8 139.6,11.8 v134,17.4 | v138,24.6 R23.1 | v143,72.4 138.6,76.8 R44.2
  Bottom 0.4: BAT_CTRL.10 156.93,8.27 v157,8.2 | v134,17.4 134,20.6 v138,24.6 139.6,23 146.8,23 147.2,23.4 147.2,40 144.4,42.8 144.4,48 148.8,52.4 148.8,67.2 143.6,72.4 v143,72.4
BAT1_PL  (via drill 0.4 pad 1.27)
  Top 0.6: R17.2 v153.2,17.6 R18.2
  Bottom 0.4: v153.2,17.6 150.4,17.6 143.9,11.1 143.9,7.5 143.4,7 141.39,7 BAT_CTRL.2
BAT2_CHARGE_EN  (via drill 0.4 pad 1.27)
  Top 0.4: v131.2,47.4 132.4,48.6 R22.1
  Bottom 0.4: BAT_CTRL.9 146.48,1.93 134.68,1.93 132.8,3.8 132.8,15.4 132,16.2 132,32.8 131.2,33.6 v131.2,47.4
BAT2_EN  (via drill 0.4 pad 1.27)
  Top 0.4: U$1.11 v40.8,21
  Bottom 0.4: v40.8,21 29.4,32.4 29.4,47.2 30.8,48.6 35.84,48.6 BAT_CONTROL.5
BAT2_OUT_EN  (via drill 0.4 pad 1.27)
  Top 0.4: v148.6,32.4 R21.1 | v143,74.2 142.1,75.1 R28.1
  Bottom 0.4: BAT_CTRL.5 143.03,3.56 135.44,3.56 134.4,4.6 134.4,12.2 137.4,15.2 144.4,15.2 148.4,19.2 148.4,32.2 v148.6,32.4 148.6,39.8 145.2,43.2 145.2,47.6 149.6,52 149.6,67.6 v143,74.2
BAT2_PL  (via drill 0.4 pad 1.27)
  Top 0.6: R19.1 v153.2,29 R20.1
  Bottom 0.4: BAT_CTRL.4 142.66,11.06 150,18.4 150,25.8 v153.2,29
BAT_GND  (via drill 0.4 pad 1.27)
  Top 0.2: DC/DC3.EPAD_M2 131.93,54.92 | 131.93,54.92 132.2,55.2 132.65,54.75 | 131.93,54.92 131.93,55.16 DC/DC3.EPAD_M1 | 132.65,54.4 132.65,54.75 | 132.65,54.75 132.95,54.75 DC/DC3.EPAD_BIG | 134.2,55.2 134.47,54.92 DC/DC3.EPAD_M3 DC/DC3.EPAD_M4
  Top 0.3: DC/DC1.7 157.1,44.9 157.2,45 | DC/DC3.2 132.47,53.48 132.65,53.65 132.65,54.4
  Top 0.4: DC/DC3.EPAD_BIG 134.2,55.2
  Top 0.6: 132.2,55.2 131,55.2 | 132.65,54.4 132.65,52.65 132.6,52.6 | 134.2,55.2 136,55.2
  other vias: 165.6,42.4 137.2,5.8
  pour Top (isolate 0.3): 122.6,0 167.8,0 167.8,91.2 122.6,91.2
  pour Bottom (isolate 0.3): 167.8,0 122.6,0 122.6,91.2 167.8,91.2
CHARGE  (via drill 0.4 pad 1.27)
  Top 0.4: L1.2 147.8,47.16 R27.1 147.76,50.56 149.6,52.4 C17.+ v151,51.2 | R28.2 143,76.6 143.8,75.8 146.4,75.8 v147.2,75
  Top 0.6: U$6.S 143.05,46.15 145.4,43.8 | 145.4,43.8 L1.2 | U$5.S 144.15,42.55 145.4,43.8
  Top 0.61: D12.A 147.8,51.38 L1.2
  Bottom 0.4: v147.2,75 149.8,75 150.6,74.2 150.6,51.6 v151,51.2
CHARGE_DETECT  (via drill 0.4 pad 1.27)
  Top 0.4: U$1.18 53.6,23 v50.6,26
  Bottom 0.3: 44.6,44.6 44.23,44.97 42.01,44.97 BAT_CONTROL.3
  Bottom 0.4: v50.6,26 50.6,38.6 44.6,44.6
D4  (via drill 0.4 pad 1.27)
  Top 0.406: U$1.37 54.4,34.2 56.6,36.4 67.6,36.4 v70.8,39.6
  Bottom 0.406: v70.8,39.6 70.94,39.74 LCD.7
D5  (via drill 0.4 pad 1.27)
  Top 0.406: U$1.38 53.6,34.4 56.4,37.2 66.6,37.2 v68.2,38.8
  Bottom 0.406: v68.2,38.8 69.68,40.28 69.68,44.94 LCD.8
D6  (via drill 0.4 pad 1.27)
  Top 0.406: U$1.39 52.8,34.6 56.2,38 65.6,38 v66.4,38.8
  Bottom 0.406: v66.4,38.8 68.4,40.8 LCD.5
D7  (via drill 0.4 pad 1.27)
  Top 0.406: U$1.40 52,35 55.8,38.8 64.2,38.8 v64.6,39.2
  Bottom 0.406: v64.6,39.2 67.13,41.73 67.13,44.93 LCD.6
DEN
  Top 0.254: 137.8,102.8 139.25,104.25 GYRO1.8
  Top 0.4: U$9.D7 128.2,107.3 128.2,104.8 130.2,102.8 137.8,102.8
E  (via drill 0.4 pad 1.27)
  Top 0.406: U$1.41 51.2,35.4 v55.8,40
  Bottom 0.406: v55.8,40 63.8,40 65.86,42.06 LCD.3
EN
  Top 0.25: 133.9,57.74 137.6,61.44 R37.2
  Top 0.254: DC/DC3.10 133.9,57.74 | R37.2 R38.2
G_MOTOR  (via drill 0.4 pad 1.27)
  Top 0.3: I_IC1.P$6 I_IC1.P$7 I_IC1.P$8
  Top 0.4: DRV1.7 104.36,82.67 | 104.36,82.67 DRV1.EPAD_VIA1 | DRV1.EPAD_T DRV1.EPAD_VIA2 104.73,82.3 104.36,82.67 | DRV1.EPAD_VIA5 DRV1.EPAD_VIA4
  Top 1: 109.8,71 109.7,70.9 I_IC1.P$7 107.3,70.9 107.2,71
  Top 1.27: 103,81.8 DRV1.EPAD_T 107,81.8
  Bottom 1.27: 103,81.8 DRV1.EPAD_T 107,81.8
  other vias: 116.2,68.2 101.6,64.6
  pour Top (isolate 0.3): 90.8,53 119.6,53 119.6,91.2 90.8,91.2
  pour Bottom (isolate 0.3): 119.6,53 90.8,53 90.8,91.2 119.6,91.2
GND  (via drill 0.4 pad 1.27)
  other vias: 20,8.2 34,10.4 47,30.8 60.6,28 49.4,46.4
  pour Top (isolate 0.25): 17.8,0 88,0 88,50 17.8,50
  pour Bottom (isolate 0.25): 88,0 17.8,0 17.8,50 88,50
GNDI  (via drill 0.4 pad 1.27)
  Top 0.2: USB1.10 37,68.4 36.8,68.4
  Top 0.305: 47.2,71.4 47.1,71.3 IC1.3 45.55,71.3 45.25,71.6 45.2,71.6 | U$3.GND 48.55,77.85 48.2,78.2
  other vias: 48.6,70.8
  pour Top (isolate 0.25): 17.8,53 52.8,53 52.8,91.2 17.8,91.2
  pour Bottom (isolate 0.25): 52.8,53 17.8,53 17.8,91.2 52.8,91.2
I2C_GND
  pour Bottom (isolate 0.25): 119.6,50 109.4,50 109.4,0 119.6,0
  pour Top (isolate 0.25): 109.4,50 119.6,50 119.6,0 109.4,0
I2C_SCL
  Bottom 1.27: I2C_SLAVE_4.3 I2C_SLAVE_3.3 I2C_SLAVE_2.3 I2C_SLAVE_1.3 I2C_MASTER.3
I2C_SDA
  Bottom 1.27: I2C_MASTER.2 I2C_SLAVE_1.2 I2C_SLAVE_2.2 I2C_SLAVE_3.2 I2C_SLAVE_4.2
I2C_VCC
  pour Top (isolate 0.25): 90.8,50 101,50 101,0 90.8,0
  pour Bottom (isolate 0.25): 101,50 90.8,50 90.8,0 101,0
INT1
  Top 0.25: 137.8,103.6 138.75,104.56 GYRO1.7
  Top 0.4: U$9.B0 129,107.63 129,105.2 130.6,103.6 137.8,103.6
INT2
  Top 0.25: 137.8,104.4 138.25,104.86 GYRO1.6
  Top 0.4: U$9.B1 129.8,107.97 129.8,105.6 131,104.4 137.8,104.4
LCD_PWM  (via drill 0.4 pad 1.27)
  Top 0.406: U$1.44 48.8,36 53,40.2 53,42.6 v55.8,45.4
  Bottom 0.406: v55.8,45.4 62.52,45.4 LCD.2
LED
  Top 0.4: U$9.C1 127.45,120 128.6,120 129.6,121 134,121 135.02,119.98 R50.1
LED_DRIVER  (via drill 0.4 pad 1.27)
  Top 0.406: v59,19.2 U$1.22 | LED_DR1.6 56.97,13.23 56.4,13.8 v56.4,14.8
  Bottom 0.406: v59,19.2 59,17.4 v56.4,14.8
MAIN_VCC  (via drill 0.4 pad 1.27)
  Top 0.6: R34.2 154.76,59.64 v154.2,60.2 | v157.4,73.8 L2.2 C23.+ 163.4,76.6 | JP4.1 164.13,77.33 163.4,76.6 | R28.4 161.85,78.15 163.4,76.6
  Bottom 0.6: v154.2,60.2 154.2,70.6 v157.4,73.8
MISO  (via drill 0.4 pad 1.27)
  Top 0.25: v132,106.4 134.4,106.4 134.5,106.5 GYRO1.4
  Top 0.4: U$9.B4 130.76,110.4 v131.4,110.4 | SV2.6 147.26,108.06 v147.2,108
  Bottom 0.4: v131.4,110.4 132,109.8 v132,106.4 145.6,106.4 v147.2,108
MOSI  (via drill 0.4 pad 1.27)
  Top 0.254: GYRO1.3 134,107
  Top 0.3: SV2.3 152.8,109.33 151.02,109.33
  Top 0.4: 134,107 133.03,107 U$9.B3 127.43,112.6 v127.4,112.6 | 151.02,109.33 146.53,109.33 145.2,108 145.2,105.8 v144.2,104.8
  Bottom 0.4: v144.2,104.8 131.6,104.8 130.4,106 130.4,109.6 v127.4,112.6
MOTOR_CURRENT  (via drill 0.4 pad 1.27)
  Top 0.4: U$1.8 37.6,23.4 37.2,23.8 36.2,23.8 35.2,22.8 35.2,13.2 39.4,9 v39.8,8.6
  Bottom 0.4: MOTOR_CONTROL.6 42.79,8.6 v39.8,8.6
MOTOR_PWM1  (via drill 0.4 pad 1.27)
  Top 0.4: U$1.23 62.6,21 64.8,18.8 v65.2,18.4 R41.2
  Bottom 0.4: MOTOR_CONTROL.3 48.6,7.6 53.2,12.2 53.2,18.2 56,21 62.6,21 v65.2,18.4
MOTOR_PWM2  (via drill 0.4 pad 1.27)
  Top 0.4: U$1.24 65.2,21.8 v66.8,20.2 67.4,20.2 68.91,20.2 R5.2
  Bottom 0.4: MOTOR_CONTROL.5 49.94,10.14 52.4,12.6 52.4,18.6 55.6,21.8 65.2,21.8 v66.8,20.2
MOTOR_TEMP  (via drill 0.4 pad 1.27)
  Top 0.4: U$1.7 38,24.2 37.6,24.6 35.8,24.6 34.4,23.2 34.4,12.2 39.4,7.2 v39.8,6.8
  Bottom 0.4: MOTOR_CONTROL.4 43.53,6.8 v39.8,6.8
N$1
  Top 0.406: 63.6,27 arc-90 63.2,26.6 U$1.30
  Top 1.27: U$2.3 64.4,27.8 arc-90 63.6,27
N$2
  Top 0.406: U$1.33 59.6,29 59.94,29.34 C4.2
N$3  (via drill 0.4 pad 1.27)
  Top 0.406: U$1.13 49.6,14.8 v48.6,13.8
  Bottom 0.406: v48.6,13.8 40.4,13.8 38.2,11.6 37.8,11.6 32,5.8 29.2,5.8 27.12,3.72 JP1.5
N$4  (via drill 0.4 pad 1.27)
  Top 0.406: U$1.14 v50.4,13.8
  Bottom 0.406: v50.4,13.8 49.2,12.6 48.2,12.6 48,12.8 40.6,12.8 38.6,10.8 38,10.8 32.2,5 30.8,5 29.66,3.86 JP1.4
N$5
  Bottom 0.4: BAT_CTRL.6 145.2,9.8 146,10.6 162,10.6 163.87,12.47 JP3.1
N$6
  Bottom 0.4: BAT_CTRL.8 147.74,9.34 148.2,9.8 162.8,9.8 162.93,9.93 JP3.2
N$7
  Top 0.305: R13.2 30.56,73.5 X1.1
  Top 0.406: IC2.P$3 26.6,73.4 | 26.6,73.4 28,74.8 29.26,74.8 X1.1 | IC2.P$1 26.2,71.4 26.6,71.8 26.6,73.4
N$8
  Top 0.406: U$1.25 66.4,22.6 66.97,22.03 R6.2
N$9  (via drill 0.4 pad 1.27)
  Top 0.406: U$1.9 v36.8,22.6
  Bottom 0.4: 32.28,18.08 v36.8,22.6
  Bottom 0.406: 32.28,18.08 23.17,18.08 POTENTIOMETR.4
N$10  (via drill 0.4 pad 1.27)
  Top 0.4: v165.2,32.4 165.3,32.5 U$8.D
  Bottom 0.4: v165.2,32.4 153.8,32.4 151.8,30.4 151.8,28.8 149.2,26.2 149.2,18.8 144.8,14.4 137.8,14.4 135.2,11.8 135.2,5 135.8,4.4 141.33,4.4 BAT_CTRL.3
N$11
  Top 0.406: R7.1 62.64,34.04 62.2,33.6 U$2.1
N$12  (via drill 0.4 pad 1.27)
  Top 0.2: USB1.12 37.8,67 37,66.2
  Top 0.305: R8.2 44,66.8 43.8,66.6 v41.6,66.6 | ESD1.5 40.25,76.35 v40,76.6 | 28.2,63.5 28.16,63.46 R16.1 C9.1 | U$3.VCCA 49.2,78 48.4,78.8 42.2,78.8 v40,76.6 | IC4.5 33.15,78.65 35.2,76.6 v40,76.6 | R14.2 37.76,83.64 v38.2,83.2
  Top 0.406: 37,66.2 v34.3,63.5 28.2,63.5 U$4.2
  Bottom 0.305: v34.3,63.5 37.4,66.6 v41.6,66.6 43,66.6 44.6,68.2 44.6,72 v40,76.6 38.2,78.4 v38.2,83.2
N$13
  Top 0.813: LED1.A R5.1
N$14  (via drill 0.4 pad 1.27)
  other vias: 76.88,103.51
  pour Bottom (isolate 0.3): 87.8,94.2 17.8,94.2 17.8,127 87.8,127
N$15  (via drill 0.4 pad 1.27)
  other vias: 31.06,102.88
  pour Top (isolate 0.3): 17.8,94.2 87.8,94.2 87.8,127 17.8,127
N$16  (via drill 0.4 pad 1.27)
  Top 0.3: SV1.7 75.61,109.32 73.49,109.32
  Top 0.4: 73.49,109.32 72.97,108.8 51.6,108.8 48.4,112 arc-90 48.4,112.64 48.62,112.86 arc90 48.62,113.51 47.73,114.4 arc90 47.09,114.4 46.86,114.18 arc-90 46.22,114.18 44.8,115.6 v37.6,115.6
  Bottom 0.4: v37.6,115.6 37.58,115.58 U$7.11
N$17  (via drill 0.4 pad 1.27)
  Top 0.3: SV1.5 75.6,111.87 73.5,111.87
  Top 0.4: 73.5,111.87 72.47,111.87 71,110.4 58.8,110.4 50,119.2 v37.6,119.2
  Bottom 0.4: v37.6,119.2 30.13,119.2 U$7.13
N$18  (via drill 0.4 pad 1.27)
  Top 0.3: SV1.3 75.61,114.4 73.4,114.4
  Top 0.4: 73.4,114.4 v68.2,114.4
  Bottom 0.3: 32.6,109.4 32.43,109.23 27.78,109.23 U$7.6
  Bottom 0.4: v68.2,114.4 37.6,114.4 32.6,109.4
N$19  (via drill 0.4 pad 1.27)
  Top 0.4: SV1.1 75.35,117.2 65.8,117.2 62.8,114.2 v62.8,113
  Bottom 0.4: v62.8,113 59,109.2 53.6,109.2 arc-90 53.15,109.65 arc90 52.69,110.11 52.54,110.11 arc90 52.09,109.65 arc-90 51.63,109.2 35,109.2 33.76,107.96 U$7.5
N$20  (via drill 0.4 pad 1.27)
  Top 0.4: SV1.8 50,108.06 arc90 49.55,107.61 49.55,107.6 arc-90 49.09,107.14 48.43,107.14 arc-90 47.98,107.6 47.98,107.61 arc90 47.52,108.06 46.86,108.06 arc90 46.41,107.61 46.41,107.6 arc-90 45.95,107.14 45.29,107.14 arc-90 44.84,107.6 44.84,107.61 arc90 44.39,108.06 41.74,108.06 v35.6,114.2
  Bottom 0.3: v35.6,114.2 35.49,114.31 27.78,114.31 U$7.12
N$21  (via drill 0.4 pad 1.27)
  Top 0.4: SV1.6 72.4,110.6 71.4,109.6 55.4,109.6 52.9,112.1 arc90 52.26,112.1 arc-90 51.62,112.1 51.06,112.65 arc-90 51.06,113.3 arc90 51.06,113.94 47.6,117.4 v37.6,117.4
  Bottom 0.3: 31.8,117 31.65,116.85 27.78,116.85 U$7.14
  Bottom 0.4: v37.6,117.4 32.2,117.4 31.8,117
N$22
  Top 0.813: R6.1 LED2.A
N$23
  Top 0.2: USB1.8 36,69.6 arc90 35.65,69.25 35.65,68.93 arc-90 35.29,68.58 35.2,68.58 arc-90 34.85,68.93 34.85,69.25 arc90 34.5,69.6 34.41,69.6 arc90 34.06,69.25 34.06,68.93 arc-90 33.7,68.58 33.62,68.58 arc-90 33.26,68.93 33.26,69.25 arc90 32.91,69.6 31.96,69.6 X1.2
N$24
  Top 0.305: IC1.9 47.6,67.64 R8.1
N$25  (via drill 0.4 pad 1.27)
  Top 0.305: U$3.B1 47.9,80.9 47.8,81 46.8,81 v46.2,80.4
  Bottom 0.406: CP_UART_2.2 34.33,58.93 35.8,60.4 43.6,60.4 50,66.8 50,76.6 v46.2,80.4
N$26
  Top 0.305: IC1.11 48.6,67.64 R9.2
N$27
  Top 0.406: LED_DR1.5 59.7,14.51 60,14.2 60,7 59.44,6.43 LED_DR2.6
N$28  (via drill 0.4 pad 1.27)
  Top 0.2: USB1.2 39.8,70 40.2,70.4
  Top 0.305: ESD1.1 40.25,70.45 40.2,70.4 39.8,70.8 v39.8,71 | IC1.4 44,70.8 v43.4,71.4
  Bottom 0.305: v43.4,71.4 40.2,71.4 v39.8,71
N$29
  Top 0.406: LED_DR1.7 56.2,11.96 R11.2
N$30
  Top 0.406: LED_DR2.7 57.07,5.17 R10.2
N$31  (via drill 0.4 pad 1.27)
  Top 0.406: LED_DR1.1 68.11,10.7 v68.2,10.6
  Bottom 0.406: v68.2,10.6 RGB_1.1
N$32  (via drill 0.4 pad 1.27)
  Top 0.406: LED_DR1.2 70.03,11.96 v70.6,11.4
  Bottom 0.406: v70.6,11.4 70.73,11.27 RGB_1.2
N$33  (via drill 0.4 pad 1.27)
  Top 0.406: LED_DR1.3 71.36,13.23 v73.2,11.4
  Bottom 0.406: v73.2,11.4 73.27,11.33 RGB_1.3
N$34  (via drill 0.4 pad 1.27)
  Top 0.406: LED_DR2.1 66.11,3.9 v66.4,3.6
  Bottom 0.406: RGB_2.1 67.6,2.4 v66.4,3.6
N$35  (via drill 0.4 pad 1.27)
  Top 0.406: LED_DR2.2 66.44,5.17 66.8,4.8 v70.6,4.8
  Bottom 0.406: RGB_2.2 70.73,4.67 v70.6,4.8
N$36  (via drill 0.4 pad 1.27)
  Top 0.3: 69.6,5.8 69.66,5.86 72.54,5.86 v73.2,5.2
  Top 0.406: LED_DR2.3 66.56,6.43 67.2,5.8 69.6,5.8
  Bottom 0.406: RGB_2.3 73.27,5.13 v73.2,5.2
N$37  (via drill 3.5 pad 6)  (31 unrouted)
  other vias: 20.8,3 20.8,47 84.8,47 84.8,3 93.8,47 93.8,3 116.6,47 116.6,3 20.8,56 84.8,56 20.8,88.2 84.8,88.2 49.8,56 49.8,88.2 58.8,88.2 58.8,56 93.8,56 116.6,56 93.8,88.2 116.6,88.2 125.6,88.2 125.6,3 164.8,3 164.8,88.2 20.8,97.2 84.8,103 20.8,124 84.8,118.2 93.8,124 93.8,97.2 154.8,97.2 154.8,124
N$38
  Top 0.2: USB1.1 40,69.6
  Top 0.305: 40,69.6 40.2,69.6 | 40.2,69.6 41.2,70.6 ESD1.2 | IC1.5 41.9,70.3 41.2,69.6 40.2,69.6
N$39
  Top 0.406: IC2.P$5 20.24,72.4 R12.2
N$40  (via drill 0.4 pad 1.27)
  Top 0.305: U$3.A1 49.85,80.85 50,81 50.8,81 v51.4,80.4
  Bottom 0.406: CP_UART_2.3 36.87,58.27 38,59.4 43.6,59.4 44.6,60.4 arc-90 45.25,60.4 45.29,60.35 arc90 45.94,60.35 46.09,60.51 arc90 46.09,61.15 46.04,61.2 arc-90 46.04,61.84 46.2,61.99 arc-90 46.84,61.99 46.89,61.95 arc90 47.53,61.95 47.69,62.1 arc90 47.69,62.75 47.64,62.79 arc-90 47.64,63.44 47.79,63.59 arc-90 48.44,63.59 48.48,63.55 arc90 49.13,63.55 49.28,63.7 arc90 49.28,64.34 49.23,64.39 arc-90 49.23,65.03 50.8,66.6 50.8,79.8 v51.4,80.4
N$41  (via drill 0.4 pad 1.27)
  Top 0.305: R14.1 36.56,85.16 v36.6,85.2
  Bottom 0.305: v36.6,85.2 34.2,85.2 33.74,85.66 SW1.1
N$42
  Top 0.3: 73.2,60.4 83.2,60.4 83.2,63 73.2,60.4 | 73.2,60.4 74.4,60.6 83,60.6 83,60.8 75.2,60.8 75.8,61 83,61 83,61.2 76.8,61.2 77.2,61.4 83,61.4 83,62.8 82.8,62.8 82.8,61.6 82.6,61.6 82.6,62.6 82.4,62.6 82.4,61.6 82.2,61.6 82.2,62.6 82,62.6 82,61.6 81.8,61.6 81.8,62.4 81.6,62.4 81.6,61.6 81.4,61.6 81.4,62.4 81.2,62.4 81.2,61.6 81,61.6 81,62.2 80.8,62.2 80.8,61.6 78.4,61.6 79,61.8 80.6,61.8 80.6,62.2 79.8,62 80.4,62
N$43
  Top 0.2: USB1.7 35.6,70 34.8,70.8 33.2,70.8 31.9,72.1 29.96,72.1 X1.3
N$44
  Top 0.305: R13.1 LED3.A
N$45
  Top 0.305: R16.2 23.85,62.2 LED4.A
N$46
  Top 0.406: Q3.4 132.13,25.65 Q3.D
  Top 0.6: D4.A D3.A | D2.A D3.A | Q3.D 132.3,28.07 D3.A
N$47
  Top 0.3: 39.2,69 38.4,68.2 C7.2
  Top 0.305: IC1.6 42.4,69.8 41.6,69 39.2,69
N$48
  Top 0.305: IC1.26 48.1,74.9 47.9,75.1 U$3.B2
N$49
  Top 0.305: IC1.25 48.6,74.2 49.85,75.45 U$3.A2
N$50  (via drill 0.4 pad 1.27)
  Top 0.305: IC4.1 33.15,84.45 32.6,85 31.4,85 v31.2,85.2
  Bottom 0.305: v31.2,85.2 SW1.2
N$51  (via drill 0.4 pad 1.27)
  Top 0.305: IC4.4 31.25,81.45 31.6,81.8 42.4,81.8 | 42.4,81.8 48,81.8 | 48,81.8 48.55,81.25 U$3.VCCB | U$3.OE 49.2,81.6 49,81.8 48,81.8 | v42.4,80.4 42.4,81.8
  Bottom 0.406: CP_UART_2.1 31.79,59.39 33.8,61.4 43.4,61.4 49.2,67.2 48.8,67.2 46.4,69.6 46.4,76.4 v42.4,80.4
N$52
  pour Top (isolate 0.25): 101.8,48.6 108.6,48.6 108.6,2.6 101.8,2.6
N$53
  Top 0.2: USB1.5 37,72.36 C10.2
N$54
  Top 0.2: USB1.6 36.6,71.16 R15.2
N$55
  Top 0.2: USB1.11 37.4,68.24 C11.1
N$56
  Top 0.6: U$6.D 129.03,45.2 D1.A
N$57  (via drill 0.4 pad 1.27, 0.9 pad 1.27)
  Top 0.406: Q3.5 Q3.6 132.25,24.35 Q3.S 133.18,24.5 Q3.1 Q3.2
  Top 0.6: BAT1.1 160.23,17.63 158.6,16 C13.+ 158.55,13.6 156.2,13.6 154.76,15.04 R18.1 | Q3.1 132.45,24.35 132.4,24.4 | D1.C v129,39.2 | v130.2,22.4 132.6,22.4 132.8,22.6
  Top 1: 132.4,24.4 132.4,23 132.8,22.6 133,22.4 v152.2,22.4
  Bottom 0.6: v129,39.2 129,23.6 v130.2,22.4
  Bottom 1: v152.2,22.4 155.63,22.4 160.4,17.63 BAT1.1
N$58
  Top 0.4: Q3.3 134.55,25.65 134.84,25.36 R23.2
N$59  (via drill 0.4 pad 1.27, 0.9 pad 1.27)
  Top 0.4: Q1.5 Q1.6 142.25,24.35 Q1.S 142.55,24.35 Q1.1 Q1.2 143.32,24.48 143.4,24.4
  Top 0.6: BAT2.1 158.72,25.03 C14.+ 158.55,25.2 156.6,25.2 155.56,26.24 R20.2 | D5.C v133.4,35.6
  Top 1: 143.4,24.4 v145.8,24.4 v153.8,24.4
  Bottom 0.6: v133.4,35.6 133.4,34.4 139.6,28.2 139.6,26.23 Q1.6 145.55,24.35 v145.8,24.4
  Bottom 1: v153.8,24.4 160.37,24.4 161,25.03 BAT2.1
N$60
  Top 0.3: U$6.G 138.55,44.25 138.2,44.6 138.2,46.4 137.6,47 R24.2
N$61
  Top 0.4: U$8.G 163.75,36.75 164.2,37.2 R42.2 R43.2
N$62
  Top 0.4: Q1.4 142.13,25.65 Q1.D
  Top 0.6: Q1.D 142.4,25.92 D8.A | D6.A D8.A | D8.A D7.A
N$63
  Top 0.6: U$5.D 133.43,41.6 D5.A
N$64
  Top 0.4: Q1.3 147.65,25.65 148.6,26.6 R21.2
N$65  (via drill 0.4 pad 1.27)
  Top 0.3: U$5.G 141.35,40.65 v141.4,40.6 | 139.84,48.6 R22.2
  Top 0.4: v141.4,48.6 R22.2
  Bottom 0.3: v141.4,40.6 v141.4,48.6
N$66
  Top 0.6: R44.8 137.7,81.7 137.2,82.2 135.8,82.2 134.2,83.8 LED11.A
N$67
  Top 0.3: R25.1 164.4,44.6 163.7,43.9 DC/DC1.2
N$68
  Top 0.3: DC/DC1.4 162.3,44.9 162.6,45.2 C15.2
N$69  (via drill 0.4 pad 1.27)
  Top 0.3: v153.8,47.2 155.4,47.2 156.2,46.4 DC/DC1.6
  Top 0.4: R26.1 146.2,47.24 R27.2 146.24,45.76 v146.4,45.6
  Bottom 0.4: v153.8,47.2 148,47.2 v146.4,45.6
N$70
  Top 0.4: R44.7 LED10.A
N$71  (via drill 0.4 pad 1.27)
  Top 0.3: D9.A v162.6,39 | DC/DC1.8 155.2,44.4 v154.2,45.4
  Top 0.6: v154.2,45.4 153,45.4 152,46.4 152,47.16 R29.2
  Bottom 0.4: v154.2,45.4 154.2,42.4 157.6,39 v162.6,39
N$72
  Top 0.3: 153.16,43.16 C16.1 155.14,43.9 DC/DC1.9 152.7,43.9 L1.1 152.6,39.4 153,39 D9.C
N$73
  Top 0.3: DC/DC1.10 156.2,42.4 155.44,41.64 C16.2
N$74
  Top 0.61: R30.2 146.6,61.84 R31.2 146.73,64.17 DC/DC2.3
N$75
  Top 0.6: R28.8 142.1,82.9 143,83.8 LED9.A
N$76
  Top 0.6: C19.1 163.16,62 R32.2
N$77
  Top 0.6: DC/DC2.6 156.84,64.17 159,62 C19.2 C18.2
N$78
  Top 0.254: DC/DC3.9 134.4,57.4 136,59 C24.2
N$79
  Top 0.406: DC/DC2.4 150.11,62.9 150.6,62.4 150.6,61.24 C20.2
N$80
  Top 0.3: DC/DC3.1 129.41,54.45 R35.2
N$81
  Top 0.6: DC/DC2.1 148.7,67.7 149.4,68.4 C21.2
N$82
  Top 0.6: C21.1 153.4,68.4 154.1,67.7 DC/DC2.8 157.31,66.7 157.4,66.8 | L2.1 157.4,66.8 | 157.4,66.8 159.6,66.8 159.6,64.58 D10.C
N$83
  Top 0.6: DC/DC2.5 155.31,62.9 155.8,62.4 R34.1 R33.2
N$84
  Top 0.4: R28.7 143,82.4 143.8,83.2 146.4,83.2 147.4,84.2 LED8.A
N$85
  Top 0.254: DC/DC3.8 137.49,55.95 C26.2 C25.2
N$86
  Top 0.254: R36.2 139.2,55.84 C26.1
N$87  (via drill 0.4 pad 1.27)
  Top 0.254: DC/DC3.6 134.4,52.8 134.8,52.4 v136,52.4
  Top 0.4: v137.6,64.8 138.4,64 R37.1
  Bottom 0.254: v136,52.4 136,63.2 v137.6,64.8
N$88
  Top 0.254: DC/DC3.13 130.51,56.92 C27.2
N$89
  Top 0.3: DC/DC3.11 133.4,58.4 132.8,59 | 132.8,59 132.8,61.4 132.6,61.6 130.8,61.6 L$1.P$1 | DC/DC3.12 132.9,58.1 132.8,58.2 | 132.8,58.2 132.8,59 | C27.1 132.8,58.2
N$90
  Top 0.254: DC/DC3.7 136.99,54.45 R39.2 R40.2
N$91
  Top 0.4: R28.6 143.8,82 144.2,82.4 150,82.4 151.8,84.2 LED7.A
N$92
  Top 0.6: R28.5 152.05,79.85 156.2,84 LED6.A
N$93
  Top 0.813: LED5.A R41.1
N$94
  Top 0.3: I_IC1.P$12 I_IC1.P$13
N$95
  Top 0.3: I_IC1.P$5 I_IC1.P$4
N$96  (via drill 0.4 pad 1.27)
  Top 0.4: v97,60.4 R46.2
  Bottom 0.4: MOTOR_CTRL.1 99.87,57.53 v97,60.4
N$97
  Top 0.3: I_IC1.P$3 I_IC1.P$2 I_IC1.P$1
  Top 0.5: C33.1 108.49,84.67 DRV1.5
  Top 0.6: 109.4,84.8 109.16,84.56 C33.1
  Top 1.27: I_IC1.P$2 112.05,67.65 112.8,68.4 112.8,83.2 111.2,84.8 109.4,84.8
N$98  (via drill 0.4 pad 1.27)
  Top 0.6: v106.4,74.4 105.63,75.17 DRV1.3
  Bottom 0.3: MOTOR_CTRL.5 106.47,58.8 106.47,74.33 v106.4,74.4
N$99  (via drill 0.4 pad 1.27)
  Top 0.4: v102.4,76 103.4,76 104.36,76.97 DRV1.2
  Bottom 0.3: MOTOR_CTRL.3 103.93,58.8 103.93,60.64
  Bottom 0.4: 103.93,60.64 103.93,72.47 102.4,74 v102.4,76
N$100
  Top 0.5: DRV1.4 106.99,78.84 R45.2
N$101
  Top 1: DRV1.6 105.63,86.44 106.47,87.27 JP7.1
N$102
  Top 1: DRV1.8 103.09,86.3 103.93,87.13 JP7.2
N$103  (via drill 0.4 pad 1.27)
  Top 0.4: I_IC1.P$10 100.74,70.9 C32.1 99.36,70.76 v99,70.4
  Bottom 0.4: v99,70.4 99,63.73 MOTOR_CTRL.2
  Bottom 0.6: JP8.1 94.74,76.86 99,72.6 v99,70.4
N$104  (via drill 0.4 pad 1.27)
  Top 0.4: v109,64.6 108,64.6 105.8,66.8 105.8,70.2 104.45,71.55 I_IC1.P$9
  Bottom 0.4: MOTOR_CTRL.6 107.74,63.34 v109,64.6
N$105  (via drill 0.4 pad 1.27)
  Top 0.4: v104,74.6 99.8,74.6 95,79.4 JP8.2
  Bottom 0.4: MOTOR_CTRL.4 105.2,73.4 v104,74.6
N$106  (via drill 0.4 pad 1.27)
  Top 0.4: SV1.4 69.54,113.14 v68.2,111.8
  Bottom 0.3: 31.6,104.2 31.52,104.12 27.81,104.12 U$7.4
  Bottom 0.4: v68.2,111.8 68.2,109.6 64.2,105.6 33,105.6 31.6,104.2
N$107  (via drill 0.4 pad 1.27)
  Top 0.4: SV1.2 67.28,115.68 v64.6,113
  Bottom 0.254: U$7.3 27.78,106.69 26.02,106.69
  Bottom 0.4: v64.6,113 64.6,108 63,106.4 53.11,106.4 arc-90 52.66,106.85 52.66,106.88 arc90 52.21,107.33 51.31,107.33 arc90 50.85,106.88 50.85,106.85 arc-90 50.4,106.4 30.03,106.4 U$7.3 | 26.02,106.69 23.95,106.69 R48.2
N$108  (via drill 0.4 pad 1.27)
  Top 0.4: v82.6,112.4 85.95,112.4 LED12.A
  Bottom 0.4: R47.1 81.8,111.6 v82.6,112.4
N$109  (via drill 0.4 pad 1.27)
  Top 0.4: v21.8,108.8 19.85,108.8 LED13.A
  Bottom 0.4: R48.1 22.04,108.56 v21.8,108.8
N$110
  Top 0.4: U$9.D1 115.37,119 112.2,119 109.66,121.54 JP9.2
N$111
  Top 0.4: U$9.D0 115.7,119.8 112.6,119.8 112.2,120.2 JP9.3
N$112
  Top 0.4: R50.2 140,122.8 140,123.05 LED15.A
N$113
  Top 0.4: U$9.C4 120.4,118.5 120.4,120.2 122,121.8 123.8,121.8 124.46,122.46 JP10.2
N$114  (via drill 0.4 pad 1.27)
  Top 0.4: JP10.3 v127,122.2 | v119.4,121 119.4,118.37 U$9.C5
  Bottom 0.4: v127,122.2 120.6,122.2 v119.4,121
N$115
  Top 0.4: U$9.C3 123.63,116.4 123.8,116.4 124.3,116.9 124.3,118.38 126.72,120.8 128.2,120.8 129.54,122.14 JP10.4
N$116  (via drill 0.4 pad 1.27)
  Top 0.4: v114.6,111.4 115.4,110.6 118.05,110.6 U$9.D3
  Bottom 0.4: LIDAR1.3 123.17,103.4 117,103.4 114.6,105.8 v114.6,111.4
N$117  (via drill 0.4 pad 1.27)
  Top 0.4: v113,112.6 116,115.6 117.64,115.6 U$9.D2
  Bottom 0.4: LIDAR1.2 121.43,102.6 116.6,102.6 113,106.2 v113,112.6
N$118
  Top 0.4: U$9.B6 120.44,106.2 119.8,106.2 arc-90 119.35,106.65 arc90 118.89,107.11 117.95,107.11 arc90 117.5,106.65 arc-90 117.04,106.2 U$10.1 115.5,108.26 C43.2
N$119
  Top 0.3: U$10.3 113.99,105.09 116.62,105.09
  Top 0.4: 116.62,105.09 120.46,105.09 U$9.B7 | C42.2 113.6,101.6 112.9,102.3 U$10.3
N$120  (via drill 0.4 pad 1.27)
  other vias: 136.4,111.2
N$121  (via drill 0.4 pad 1.27)
  Top 0.4: v136,121.8 136.35,121.8 LED16.A
  Bottom 0.4: R51.2 135,120.8 v136,121.8
N$122  (via drill 0.4 pad 1.27)
  Top 0.61: DC/DC2.2 146.73,65.44 R31.1 146.6,67 v146.6,67.42 | v146.6,67.42 D11.C | C22.+ 148.2,69.03 v146.6,67.42 | D12.C v146.2,58
  Bottom 0.61: v146.2,58 146.6,58.4 v146.6,67.42
N$123
  Top 0.25: GYRO1.15 138.75,109.64 138,110.4 R49.1
N$124
  Top 0.25: GYRO1.14 139.25,109.45 C35.1
P_GND
  pour Top (isolate 0.3): 55.8,53 87.8,53 87.8,91.2 55.8,91.2
  pour Bottom (isolate 0.3): 87.8,53 55.8,53 55.8,91.2 87.8,91.2
P_VCC
  Top 0.6: RV1.P$1 80.7,86.7 77.6,89.8 71.79,89.8 POTENTIOMETR1.6
RES
  Top 0.6: RV1.P$2 78.2,79.2 79.6,80.6 79.6,86.2 77,88.8 73.33,88.8 POTENTIOMETR1.4
RESET  (via drill 0.4 pad 1.27)
  Top 0.406: U$1.32 56.8,28.2 v56.4,27.8
  Bottom 0.406: v56.4,27.8 56.4,25.4 55,24 53.4,24 51.2,21.8 51.2,14.6 51.6,14.2 51.6,13 50.4,11.8 41.6,11.8 39.8,10 38.2,10 32.2,4 JP1.3
RS  (via drill 0.4 pad 1.27)
  Top 0.406: U$1.42 50.4,35.6 54.6,39.8 54.6,40.6 v55.8,41.8
  Bottom 0.406: v55.8,41.8 56.8,40.8 63.6,40.8 64.6,41.8 64.6,44.94 LCD.4
RW  (via drill 0.4 pad 1.27)
  Top 0.4: U$1.43 49.6,35.8 53.8,40 53.8,41.6 v55.8,43.6
  Bottom 0.4: v55.8,43.6 55.86,43.66 LCD.1
RX
  Top 0.406: U$1.20 55.2,17.2 56.4,16 78.4,16 | 78.4,16 79.4,16 82.07,13.33 PSOC_UART.3 | R3.1 78.4,16
SCL  (via drill 0.4 pad 1.27)
  Top 0.406: U$1.28 69.6,25 75,30.4 75,32.6 78.6,36.2 I2C.3 | R2.1 v69.99,30.01 v70,30
  Bottom 0.406: v70,30 72.4,30 78.6,36.2 I2C.3
SCLK  (via drill 0.4 pad 1.27)
  Top 0.254: 134,108 134.5,107.5 GYRO1.2
  Top 0.4: U$9.B5 132.78,110.78 v133.2,110.36 133.2,108.8 134,108 | SV2.4 v147.2,110.6
  Bottom 0.4: v147.2,110.6 138.2,110.6 137.2,109.6 133.96,109.6 v133.2,110.36
SDA
  Top 0.406: U$1.29 69.2,25.8 72.1,28.7 | 72.1,28.7 74.2,30.8 74.2,33 79.94,38.74 I2C.2 | R1.1 71.98,28.82 72.1,28.7
SENSOR_ALARM
  Top 0.406: U$1.27 70,24.2 75.8,30 75.8,32.2 77.26,33.66 I2C.4
SPEEDOMER
  Top 0.406: U$1.26 70.4,23.4 71.8,24.8 SPEEDOMETR.2
SS
  Top 0.25: GYRO1.5 133.2,106 132.4,105.2
  Top 0.4: 132.4,105.2 131.4,105.2 130.6,106 130.6,108.3 U$9.B2
TX  (via drill 0.4 pad 1.27)
  Top 0.406: U$1.21 56,17.6 56.8,16.8 79.8,16.8 80.73,15.87 PSOC_UART.2 | R4.1 74.75,14.45 v74.6,14.6
  Bottom 0.406: v74.6,14.6 79.46,14.6 80.73,15.87 PSOC_UART.2
V_MOTOR
  Top 0.3: I_IC1.P$14 I_IC1.P$15 I_IC1.P$16
  Top 1.27: JP6.2 93.67,70.73 94.2,70.2 C31.+ 94.25,67.65 I_IC1.P$15
VBAT  (via drill 0.4 pad 1.27)
  Top 0.254: DC/DC3.4 DC/DC3.5 133.9,51.3
  Top 0.3: 133.4,51.2 v133.6,51 133.9,51.3
  Top 0.4: D4.C D3.C D2.C D6.C D8.C D7.C
  Top 0.6: D7.C 142.58,32.23 142.4,32.4 v142.4,33 | 132.4,49.8 v133.6,51
  Top 0.61: v144,64 D11.A | 132.4,49.8 C30.+
  Bottom 0.6: v142.4,33 142.4,39.8 142.6,40 142.6,51.2 | 142.6,51.2 142.6,61.6 | v133.6,51 142.4,51 142.6,51.2
  Bottom 0.61: 142.6,61.6 142.6,62.6 v144,64
VBUS  (via drill 0.4 pad 1.27)
  Top 0.3: v26.6,69 23.2,69 20.8,69 | C6.2 40,67.4 v39.6,67.8
  Top 0.305: v39.6,67.8 41.2,67.8 42.7,69.3 IC1.7 46.3,68.7 46.5,68.5 IC1.8 | C8.2 23.2,69 | IC4.3 v29.8,83
  Top 0.406: IC2.P$6 21.2,71.4 20.8,71 20.8,69 20.8,67.8 21.4,67.2 U$4.3
  Bottom 0.3: v39.6,67.8 32,67.8 27.8,67.8 v26.6,69
  Bottom 0.305: v29.8,83 29.8,78.2 32,76 32,67.8
VMOTOR  (via drill 0.4 pad 1.27)
  Top 0.4: R39.1 v140.8,53.8 | v137.6,66.8 134.8,66.8 L$1.P$2 | L$1.P$2 130.6,76.2 130.4,76.4 C29.+ | C28.2 132.04,72.24 131.2,71.4 131,71.4 L$1.P$2
  Top 0.6: JP5.1 128.07,80.93 130,79 C29.+ | R44.1 133.75,78.15 132.4,76.8 130.8,76.8 130.4,76.4
  Bottom 0.4: v140.8,53.8 141.6,54.6 141.6,62.8 v137.6,66.8
(copper drawn outside any net)
  shapes: Bottom area x1, Top area x21

## Text on the board
tNames: VCC | SDA | SCL | GND | ALARM | VCC | SDA | SCL | GND | ALARM | VCC | SDA | SCL | GND | ALARM | VCC | SDA | SCL | GND | ALARM